# EAGLE design breakout (EAGLE 7.1.0)

## Sheet 1 of 2
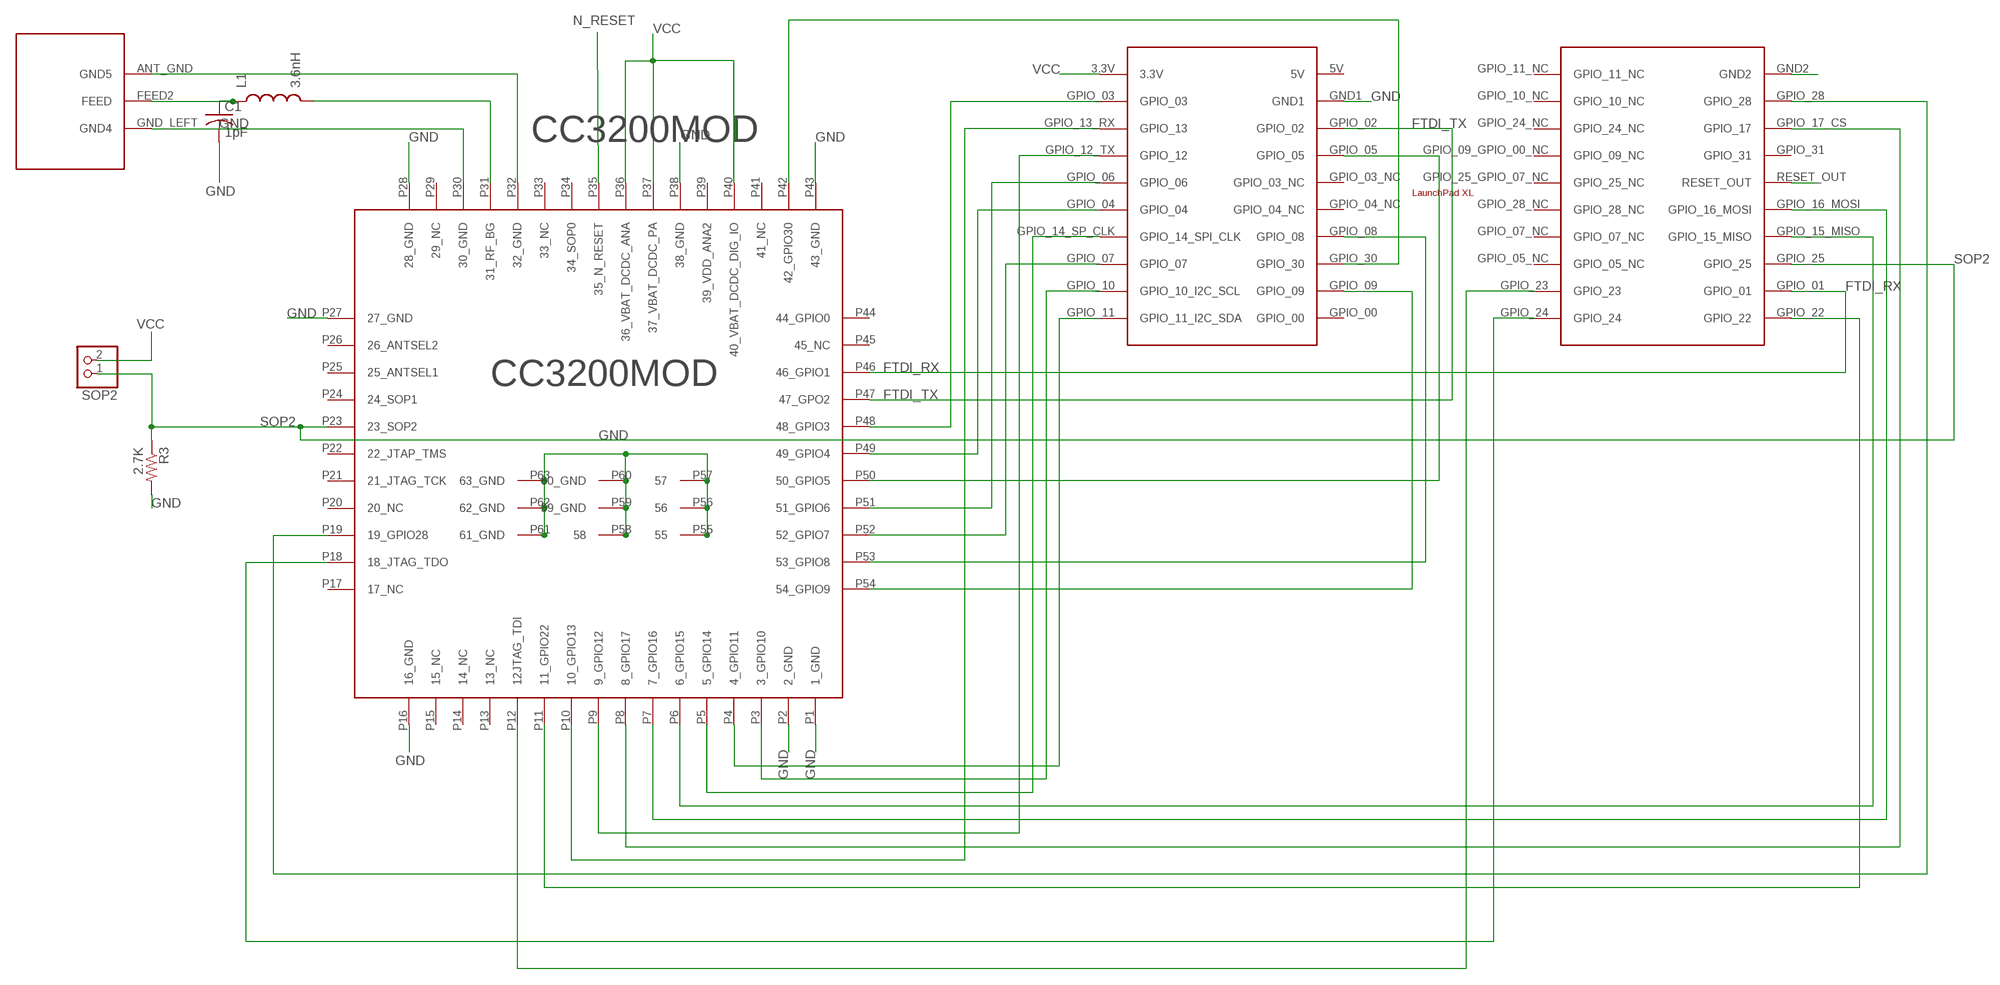
[diagram p0: schematic, sheet 1]

### Parts
ANT_PAD  ANT  [ANT]
C1  1pF  C-USC0402  [C0402]
CC3200MOD  CC3200  [CC3200MOD]
L1  3.6nH  INDUCTOR-SPARKFUN0402  [C0402]
R3  2.7K  RESISTOR0603  [0603-RES]
SOP2  PINHD-1X2  [1X02]
U11  XL  [LAUNCHPADXL]

### Nets
FTDI_RX: CC3200MOD.P46(46_GPIO1) U11.GPIO_01 ; also sheet 2
FTDI_TX: CC3200MOD.P47(47_GPO2) U11.GPIO_02 ; also sheet 2
GND: ANT_PAD.ANT_GND(GND5) ANT_PAD.GND_LEFT(GND4) C1.2 CC3200MOD.P1(1_GND) CC3200MOD.P2(2_GND) CC3200MOD.P16(16_GND) CC3200MOD.P27(27_GND) CC3200MOD.P28(28_GND) CC3200MOD.P30(30_GND) CC3200MOD.P32(32_GND) CC3200MOD.P38(38_GND) CC3200MOD.P43(43_GND) CC3200MOD.P55 CC3200MOD.P56 CC3200MOD.P57 CC3200MOD.P58 CC3200MOD.P59(59_GND) CC3200MOD.P60(60_GND) CC3200MOD.P61(61_GND) CC3200MOD.P62(62_GND) CC3200MOD.P63(63_GND) R3.2 U11.GND1 U11.GND2 ; also sheet 2
GPIO_05: CC3200MOD.P50(50_GPIO5) U11.GPIO_05 ; also sheet 2
GPIO_10: CC3200MOD.P3(3_GPIO10) U11.GPIO_10(GPIO_10_I2C_SCL) ; also sheet 2
GPIO_11: CC3200MOD.P4(4_GPIO11) U11.GPIO_11(GPIO_11_I2C_SDA) ; also sheet 2
GPIO_13: CC3200MOD.P10(10_GPIO13) U11.GPIO_13_RX(GPIO_13) ; also sheet 2
GPIO_22: CC3200MOD.P11(11_GPIO22) U11.GPIO_22
JTAG_TDI: CC3200MOD.P12(12JTAG_TDI) U11.GPIO_23
JTAG_TDO: CC3200MOD.P18(18_JTAG_TDO) U11.GPIO_24
N$2: ANT_PAD.FEED2(FEED) C1.1 L1.1
N$3: CC3200MOD.P31(31_RF_BG) L1.2
N$8: CC3200MOD.P6(6_GPIO15) U11.GPIO_15_MISO
N$10: CC3200MOD.P7(7_GPIO16) U11.GPIO_16_MOSI
N$11: CC3200MOD.P8(8_GPIO17) U11.GPIO_17_CS(GPIO_17)
N$12: CC3200MOD.P5(5_GPIO14) U11.GPIO_14_SP_CLK(GPIO_14_SPI_CLK)
N$13: CC3200MOD.P19(19_GPIO28) U11.GPIO_28
N$14: CC3200MOD.P42(42_GPIO30) U11.GPIO_30
N$18: CC3200MOD.P51(51_GPIO6) U11.GPIO_06
N$19: CC3200MOD.P49(49_GPIO4) U11.GPIO_04
N$21: CC3200MOD.P52(52_GPIO7) U11.GPIO_07
N$22: CC3200MOD.P53(53_GPIO8) U11.GPIO_08
N$23: CC3200MOD.P54(54_GPIO9) U11.GPIO_09
N$25: CC3200MOD.P9(9_GPIO12) U11.GPIO_12_TX(GPIO_12)
N$27: CC3200MOD.P48(48_GPIO3) U11.GPIO_03
N_RESET: CC3200MOD.P35(35_N_RESET) U11.RESET_OUT ; also sheet 2
SOP2: CC3200MOD.P23(23_SOP2) R3.1 SOP2.1 U11.GPIO_25 ; also sheet 2
VCC: CC3200MOD.P36(36_VBAT_DCDC_ANA) CC3200MOD.P37(37_VBAT_DCDC_PA) CC3200MOD.P40(40_VBAT_DCDC_DIG_IO) SOP2.2 U11.3.3V ; also sheet 2
Unconnected: CC3200MOD.P13(13_NC) CC3200MOD.P14(14_NC) CC3200MOD.P15(15_NC) CC3200MOD.P17(17_NC) CC3200MOD.P20(20_NC) CC3200MOD.P21(21_JTAG_TCK) CC3200MOD.P22(22_JTAP_TMS) CC3200MOD.P24(24_SOP1) CC3200MOD.P25(25_ANTSEL1) CC3200MOD.P26(26_ANTSEL2) CC3200MOD.P29(29_NC) CC3200MOD.P33(33_NC) CC3200MOD.P34(34_SOP0) CC3200MOD.P39(39_VDD_ANA2) CC3200MOD.P41(41_NC) CC3200MOD.P44(44_GPIO0) CC3200MOD.P45(45_NC) U11.5V U11.GPIO_00 U11.GPIO_03_NC U11.GPIO_04_NC U11.GPIO_05_NC U11.GPIO_07_NC U11.GPIO_09_GPIO_00_NC(GPIO_09_NC) U11.GPIO_10_NC U11.GPIO_11_NC U11.GPIO_24_NC U11.GPIO_25_GPIO_07_NC(GPIO_25_NC) U11.GPIO_28_NC U11.GPIO_31

## Sheet 2 of 2
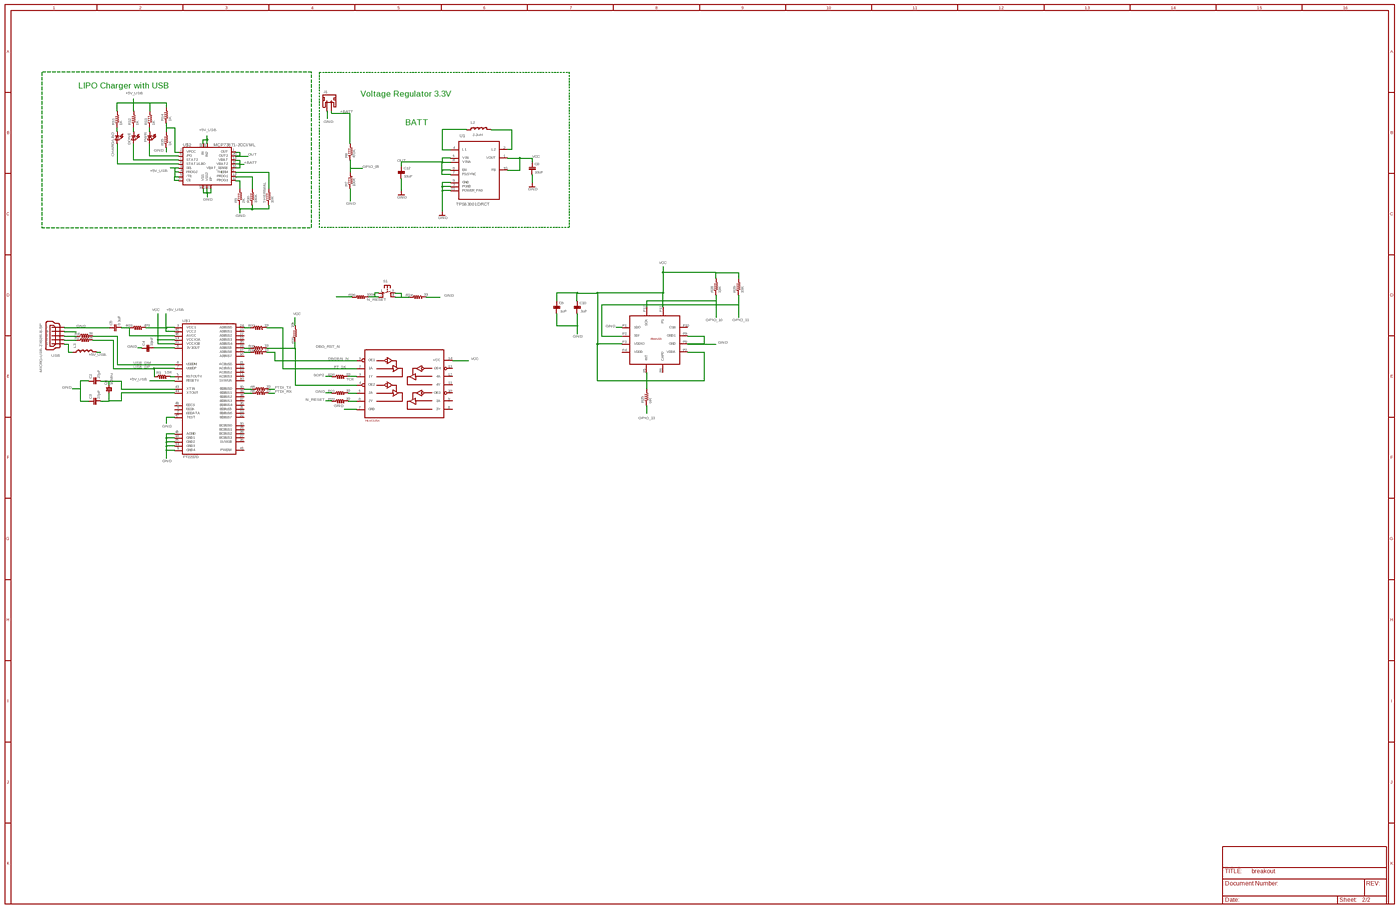
[diagram p1: schematic, sheet 2, overview]
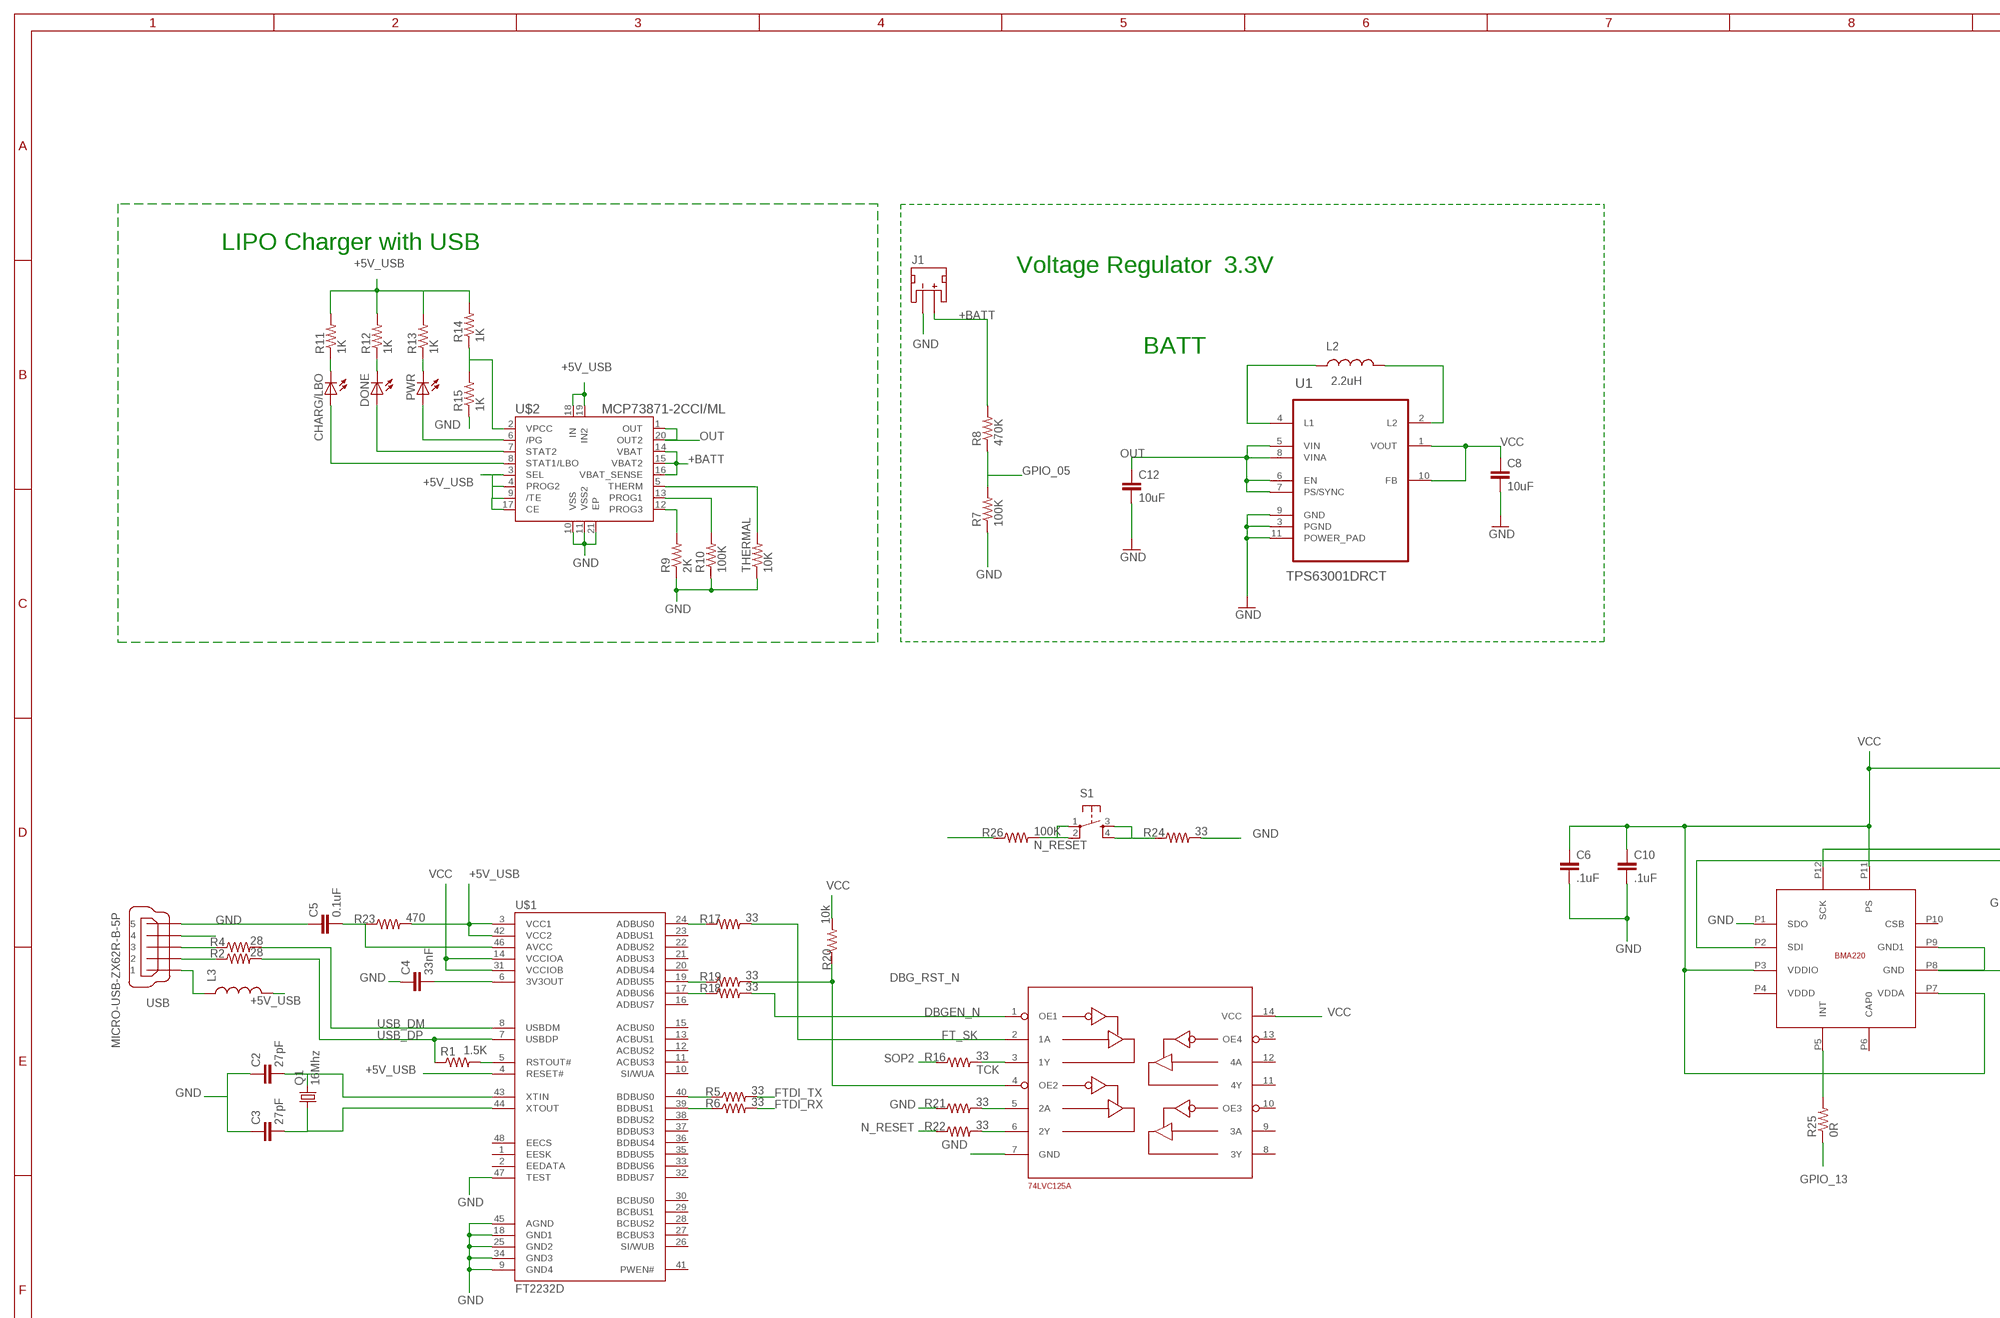
[diagram p2: schematic, sheet 2, part 1 of 4]
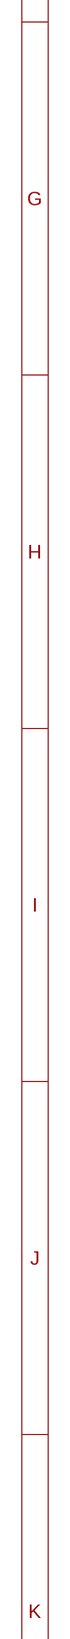
[diagram p3: schematic, sheet 2, part 2 of 4]
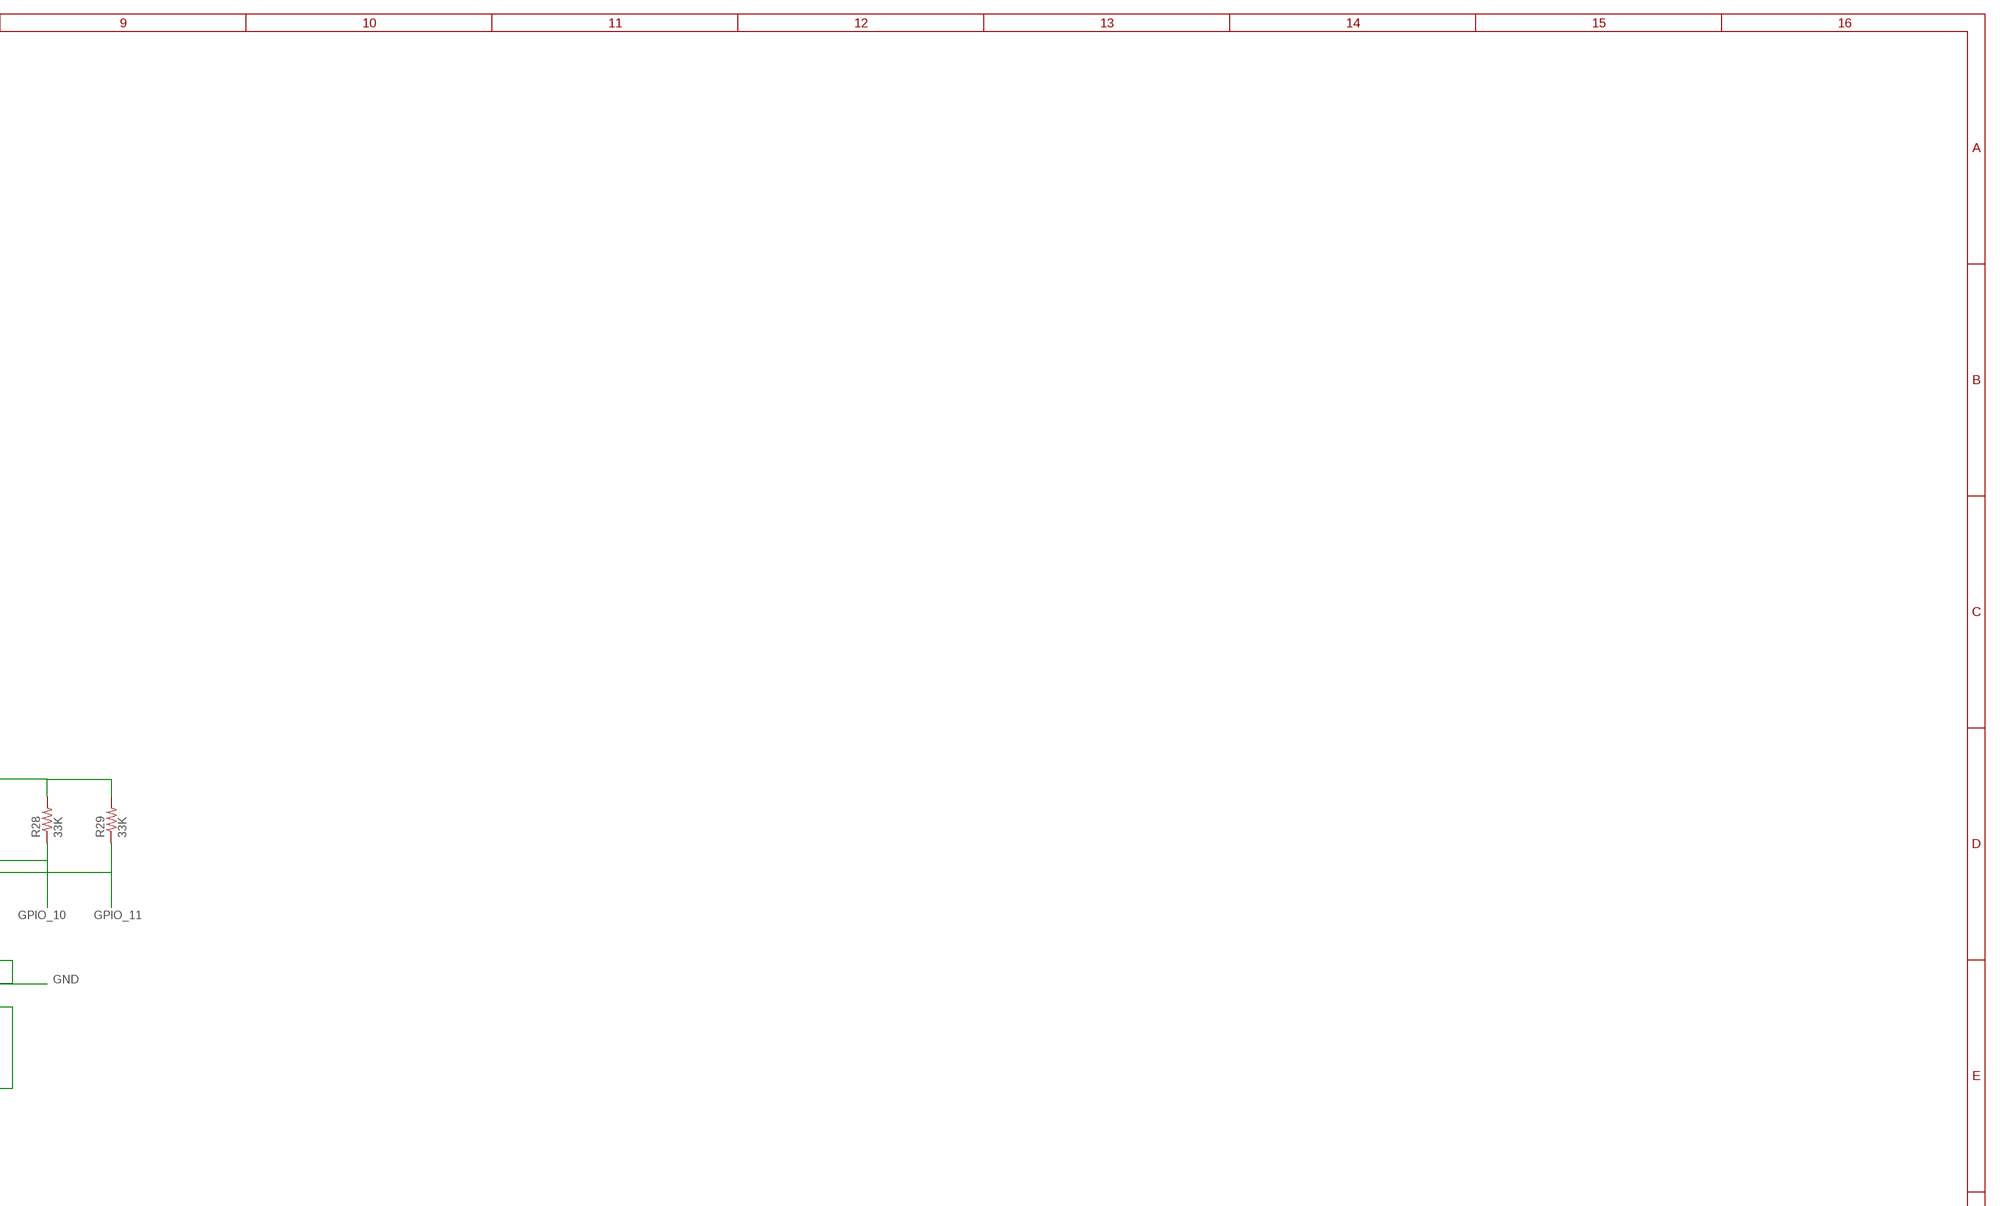
[diagram p4: schematic, sheet 2, part 3 of 4]
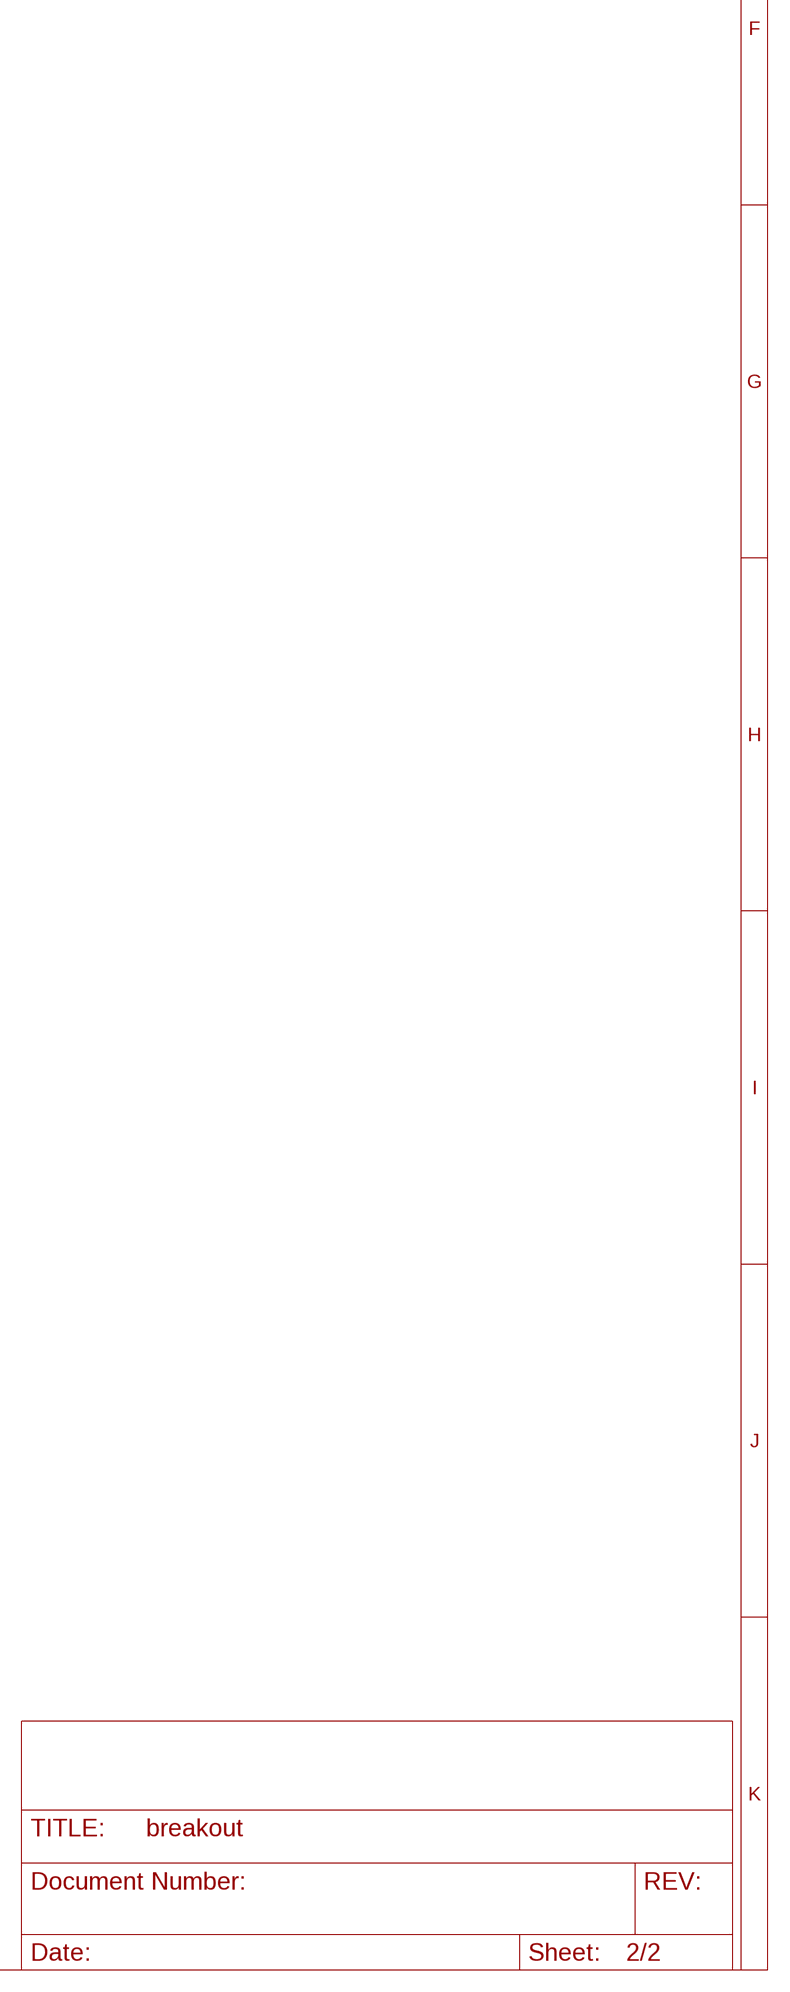
[diagram p5: schematic, sheet 2, part 4 of 4]

### Parts
C2  27pF  CAP0402-CAP  [0402-CAP]
C3  27pF  CAP0402-CAP  [0402-CAP]
C4  33nF  CAP0402-CAP  [0402-CAP]
C5  0.1uF  CAP0402-CAP  [0402-CAP]
C6  .1uF  CAP0402-CAP  [0402-CAP]
C8  10uF  C-EUC0603  [C0603]
C10  .1uF  CAP0402-CAP  [0402-CAP]
C12  10uF  C-EUC0603  [C0603]
CHARG/LBO  LEDSML0603  [SML0603]
DONE  LEDSML0603  [SML0603]
J1  JST_2MM_MALE  [JST-2-SMD]
L2  2.2uH  INDUCTOR0805  [0805]
L3  INDUCTOR-SPARKFUN0603  [0603]
PWR  LEDSML0603  [SML0603]
Q1  16Mhz  CRYSTALTC26H  [TC26H]
R1  1.5K  RESISTOR0603  [0603-RES]
R2  28  RESISTOR0603-RES  [0603-RES]
R4  28  RESISTOR0603-RES  [0603-RES]
R5  33  RESISTOR0603  [0603-RES]
R6  33  RESISTOR0603  [0603-RES]
R7  100K  RESISTOR0603  [0603-RES]
R8  470K  RESISTOR0603  [0603-RES]
R9  2K  RESISTOR0603-RES  [0603-RES]
R10  100K  RESISTOR0603-RES  [0603-RES]
R11  1K  RESISTOR0603-RES  [0603-RES]
R12  1K  RESISTOR0603-RES  [0603-RES]
R13  1K  RESISTOR0603-RES  [0603-RES]
R14  1K  RESISTOR0603-RES  [0603-RES]
R15  1K  RESISTOR0603-RES  [0603-RES]
R16  33  RESISTOR0603  [0603-RES]
R17  33  RESISTOR0603  [0603-RES]
R18  33  RESISTOR0603  [0603-RES]
R19  33  RESISTOR0603  [0603-RES]
R20  10k  RESISTOR0603  [0603-RES]
R21  33  RESISTOR0603  [0603-RES]
R22  33  RESISTOR0603  [0603-RES]
R23  470  RESISTOR0603  [0603-RES]
R24  33  RESISTOR0603  [0603-RES]
R25  0R  RESISTOR0603-RES  [0603-RES]
R26  100K  RESISTOR0603  [0603-RES]
R28  33K  RESISTOR0402-RES  [0402-RES]
R29  33K  RESISTOR0402-RES  [0402-RES]
S1  TAC_SWITCHSMD  [TACTILE_SWITCH_SMD]
THERMAL  10K  RESISTOR0603-RES  [0603-RES]
U1  TPS63001DRCT  [SON50P300X300X100-11N]
U$1  FT2232D  [LQFP-48]
U$2  MCP73871-2CCI/ML  [QFN20-4X4]
U$3  DECADE-74LVC125A  [DECADE-SO-14]
U$4  BMA220  [BMA222]
USB  MICRO-USB-ZX62R-B-5P  [ZX62R-B-5P]

### Nets
+5V_USB: L3.2 R11.2 R12.2 R13.2 R14.2 R23.2 U$1.3(VCC1) U$1.4(RESET#) U$1.42(VCC2) U$2.3(SEL) U$2.4(PROG2) U$2.9(/TE) U$2.17(CE) U$2.18(IN) U$2.19(IN2)
+BATT: J1.2(+) R8.2 U$2.14(VBAT) U$2.15(VBAT2) U$2.16(VBAT_SENSE)
DBG_RST_N: R19.2 R20.1 U$3.4(OE2)
DBGEN_N: R18.2 U$3.1(OE1)
FT_SK: R17.2 U$3.2(1A)
FTDI_RX: R6.2 ; also sheet 1
FTDI_TX: R5.2 ; also sheet 1
GND: C2.1 C3.1 C4.1 C5.1 C6.2 C8.2 C10.2 C12.2 J1.1(-) R7.1 R9.1 R10.1 R15.1 R21.1 R24.2 THERMAL.1 U1.3(PGND) U1.9(GND) U1.11(POWER_PAD) U$1.9(GND4) U$1.18(GND1) U$1.25(GND2) U$1.34(GND3) U$1.45(AGND) U$1.47(TEST) U$2.10(VSS) U$2.11(VSS2) U$2.21(EP) U$3.7(GND) U$4.P1(SDO) U$4.P8(GND) U$4.P9(GND1) USB.5 ; also sheet 1
GPIO_05: R7.2 R8.1 ; also sheet 1
GPIO_10: R28.1 U$4.P12(SCK) ; also sheet 1
GPIO_11: R29.1 U$4.P2(SDI) ; also sheet 1
GPIO_13: R25.1 ; also sheet 1
N$7: R1.2 U$1.5(RSTOUT#)
N$15: L3.1 USB.1
N$17: R9.2 U$2.12(PROG3)
N$20: R10.2 U$2.13(PROG1)
N$26: PWR.A U$2.6(/PG)
N$28: THERMAL.2 U$2.5(THERM)
N$29: L2.1 U1.4(L1)
N$30: L2.2 U1.2(L2)
N$31: DONE.A U$2.7(STAT2)
N$32: CHARG/LBO.A U$2.8(STAT1/LBO)
N$33: CHARG/LBO.C R11.1
N$35: DONE.C R12.1
N$36: PWR.C R13.1
N$37: R14.1 R15.2 U$2.2(VPCC)
N$38: C2.2 Q1.2 U$1.43(XTIN)
N$39: USB.4
N$40: C3.2 Q1.1 U$1.44(XTOUT)
N$41: R4.1 USB.3
N$42: R2.1 USB.2
N$43: C4.2 U$1.6(3V3OUT)
N$44: R5.1 U$1.40(BDBUS0)
N$45: R6.1 U$1.39(BDBUS1)
N$46: R17.1 U$1.24(ADBUS0)
N$47: R19.1 U$1.19(ADBUS5)
N$48: R18.1 U$1.17(ADBUS6)
N$49: R21.2 U$3.5(2A)
N$50: R22.2 U$3.6(2Y)
N$51: C5.2 R23.1 U$1.46(AVCC)
N$52: R25.2 U$4.P5(INT)
N$53: R24.1 S1.3 S1.4
N_RESET: R22.1 R26.2 S1.1 S1.2 ; also sheet 1
OUT: C12.1 U1.5(VIN) U1.6(EN) U1.7(PS/SYNC) U1.8(VINA) U$2.1(OUT) U$2.20(OUT2)
SOP2: R16.1 ; also sheet 1
TCK: R16.2 U$3.3(1Y)
USB_DM: R4.2 U$1.8(USBDM)
USB_DP: R1.1 R2.2 U$1.7(USBDP)
VCC: C6.1 C8.1 C10.1 R20.2 R26.1 R28.2 R29.2 U1.1(VOUT) U1.10(FB) U$1.14(VCCIOA) U$1.31(VCCIOB) U$3.14(VCC) U$4.P3(VDDIO) U$4.P7(VDDA) U$4.P11(PS) ; also sheet 1
Unconnected: J1.NC1(PAD1) J1.NC2(PAD2) U$1.1(EESK) U$1.2(EEDATA) U$1.10(SI/WUA) U$1.11(ACBUS3) U$1.12(ACBUS2) U$1.13(ACBUS1) U$1.15(ACBUS0) U$1.16(ADBUS7) U$1.20(ADBUS4) U$1.21(ADBUS3) U$1.22(ADBUS2) U$1.23(ADBUS1) U$1.26(SI/WUB) U$1.27(BCBUS3) U$1.28(BCBUS2) U$1.29(BCBUS1) U$1.30(BCBUS0) U$1.32(BDBUS7) U$1.33(BDBUS6) U$1.35(BDBUS5) U$1.36(BDBUS4) U$1.37(BDBUS3) U$1.38(BDBUS2) U$1.41(PWEN#) U$1.48(EECS) U$3.8(3Y) U$3.9(3A) U$3.10(OE3) U$3.11(4Y) U$3.12(4A) U$3.13(OE4) U$4.P4(VDDD) U$4.P6(CAP0) U$4.P10(CSB)

### Notes on the sheet
- LIPO Charger with USB
- Voltage Regulator | 3.3V
- BATT

## Library data of the parts
ANT_PAD = Antenna:ANT
C1 = rcl:C-US: CAPACITOR, American symbol
C2-C5 = SparkFun-Passives:CAP: Capacitor Standard 0603 ceramic capacitor, and 0.1" leaded capacitor.
C6 C10 = SparkFun-Capacitors:CAP: Capacitor Standard 0603 ceramic capacitor, and 0.1" leaded capacitor.
C8 C12 = rcl:C-EU: CAPACITOR, European symbol
CC3200MOD = cc3200mod:CC3200
CHARG/LBO DONE PWR = led:LED: LED OSRAM: - CHIPLED LG R971, LG N971, LY N971, LG Q971, LY Q971, LO R971, LY R971 LH N974, LH R974 LS Q976, LO Q976, LY Q976 LO Q996 - Hyper CHIPLED LW Q18S LB Q993, LB Q99A, LB R99A - SideLED LS A670, LO A670, LY A670, LG A670, LP A670 LB A673, LV A673, LT A673, LW A673 LH A674 LY A675 LS A676, LA A676, LO A676, LY A676, LW A676 LS A679, LY A679, LG A679 - Hyper Micro SIDELED® LS Y876, LA Y876, LO Y876, LY Y876 LT Y87S - SmartLED LW L88C, LW L88S LB L89C, LB L89S, LG L890 LS L89K, LO L89K, LY L89K LS L896, LA L896, LO L896, LY L896 - TOPLED LS T670, LO T670, LY T670, LG T670, LP T670 LSG T670, LSP T670, LSY T670, LOP T670, LYG T670 LG T671, LOG T671, LSG T671 LB T673, LV T673, LT T673, LW T673 LH T674 LS T676, LA T676, LO T676, LY T676, LB T676, LH T676, LSB T676, LW T676 LB T67C, LV T67C, LT T67C, LS T67K, LO T67K, LY T67K, LW E67C LS E67B, LA E67B, LO E67B, LY E67B, LB E67C, LV E67C, LT E67C LW T67C LS T679, LY T679, LG T679 LS T770, LO T770, LY T770, LG T770, LP T770 LB T773, LV T773, LT T773, LW T773 LH T774 LS E675, LA E675, LY E675, LS T675 LS T776, LA T776, LO T776, LY T776, LB T776 LHGB T686 LT T68C, LB T68C - Hyper Mini TOPLED® LB M676 - Mini TOPLED Santana® LG M470 LS M47K, LO M47K, LY M47K Source: http://www.osram.convergy.de LUXEON: - LUMILED® LXK2-PW12-R00, LXK2-PW12-S00, LXK2-PW14-U00, LXK2-PW14-V00 LXK2-PM12-R00, LXK2-PM12-S00, LXK2-PM14-U00 LXK2-PE12-Q00, LXK2-PE12-R00, LXK2-PE12-S00, LXK2-PE14-T00, LXK2-PE14-U00 LXK2-PB12-K00, LXK2-PB12-L00, LXK2-PB12-M00, LXK2-PB14-N00, LXK2-PB14-P00, LXK2-PB14-Q00 LXK2-PR12-L00, LXK2-PR12-M00, LXK2-PR14-Q00, LXK2-PR14-R00 LXK2-PD12-Q00, LXK2-PD12-R00, LXK2-PD12-S00 LXK2-PH12-R00, LXK2-PH12-S00 LXK2-PL12-P00, LXK2-PL12-Q00, LXK2-PL12-R00 Source: www.luxeon.com KINGBRIGHT: KA-3528ASYC Source: www.kingbright.com
J1 = SparkFun-Connectors:JST_2MM_MALE: Mates to single-cell LiPo batteries. CONN-08352; PROD_ID: CONN-08352
L1 L3 = Spark:INDUCTOR-SPARKFUN: Inductors Basic Inductor/Choke - 0603 and 1206. Footprints are not proven and vary greatly between part numbers. SRN6045- 33uH, 20% 1.4A
L2 = SparkFun-Passives:INDUCTOR: Inductors Basic Inductor/Choke - 0603 and 1206. Footprints are not proven and vary greatly between part numbers. SRN6045- 33uH, 20% 1.4A SDR0403-560KL - 56uH, 10%, 500mA RMS/740mA peak
Q1 = crystal:CRYSTAL: CRYSTAL; OC_FARNELL: unknown; OC_NEWARK: unknown
R1 R3 R5-R8 R16-R24 R26 = SparkFun-Resistors:RESISTOR: Resistor Basic schematic elements and footprints for 0603, 1206, and PTH resistors.
R2 R4 R9-R15 R25 R28 R29 THERMAL = SparkFun-Passives:RESISTOR: Resistor Basic schematic elements and footprints for 0603, 1206, and PTH resistors.
S1 = Spark:TAC_SWITCH: SMD Tactiile Switch
SOP2 = pinhead:PINHD-1X2: PIN HEADER
U1 = TPS63001:TPS63001DRCT: HIGH EFFICIENT SINGLE INDUCTOR BUCK-BOOST CONVERTER WITH 1.8-A SWITCHES; MPN: TPS63001DRCT; OC_FARNELL: 1652399; OC_NEWARK: 22M1824; PACKAGE: SON-10; SUPPLIER: TEXAS INSTRUMENTS
U11 = LaunchPadXL:XL
U$1 = SparkFun-DigitalIC:FT2232D: USB to USART/FIFO/JTAG/SPI/I2C
U$2 = microchip-battery:MCP73871: Stand-Alone System Load Sharing and Li-Ion / Li-Polymer Battery Charge Managemen The MCP73871 device is a 1A fully integrated linear solution for system load sharing and Li-Ion / Li-Polymer battery charge management with AC-DC wall adapter and USB port power sources selection. It?s also capable of autonomous power source selection between input or battery. The MCP73871 device employs a constant current/constant voltage (CC/CV) charge algorithm with selectable charge termination point. The constant voltage regulation is fixed with four available options: 4.10V, 4.20V, 4.35V, or 4.40V.; LBO: 3.1 V; SAFETYTIMER: 6 Hours; VREG: 4.20V
U$3 = DECADE-libraries:DECADE-74LVC125A
U$4 = bma220:BMA220: The BMA220 is an ultra small triaxial, low-g acceleration sensor with digital interfaces, aiming for low-power consumer market applications.
USB = con-hirose:MICRO-USB-: Hirose Micro USB Connector ZX62R-B-5P: Micro B, reverse (top mount) shell SMT Supplier: DigiKey H11574CT-ND Source: http://www.hirose.co.jp/cataloge_hp/e24200011.pdf

## Board
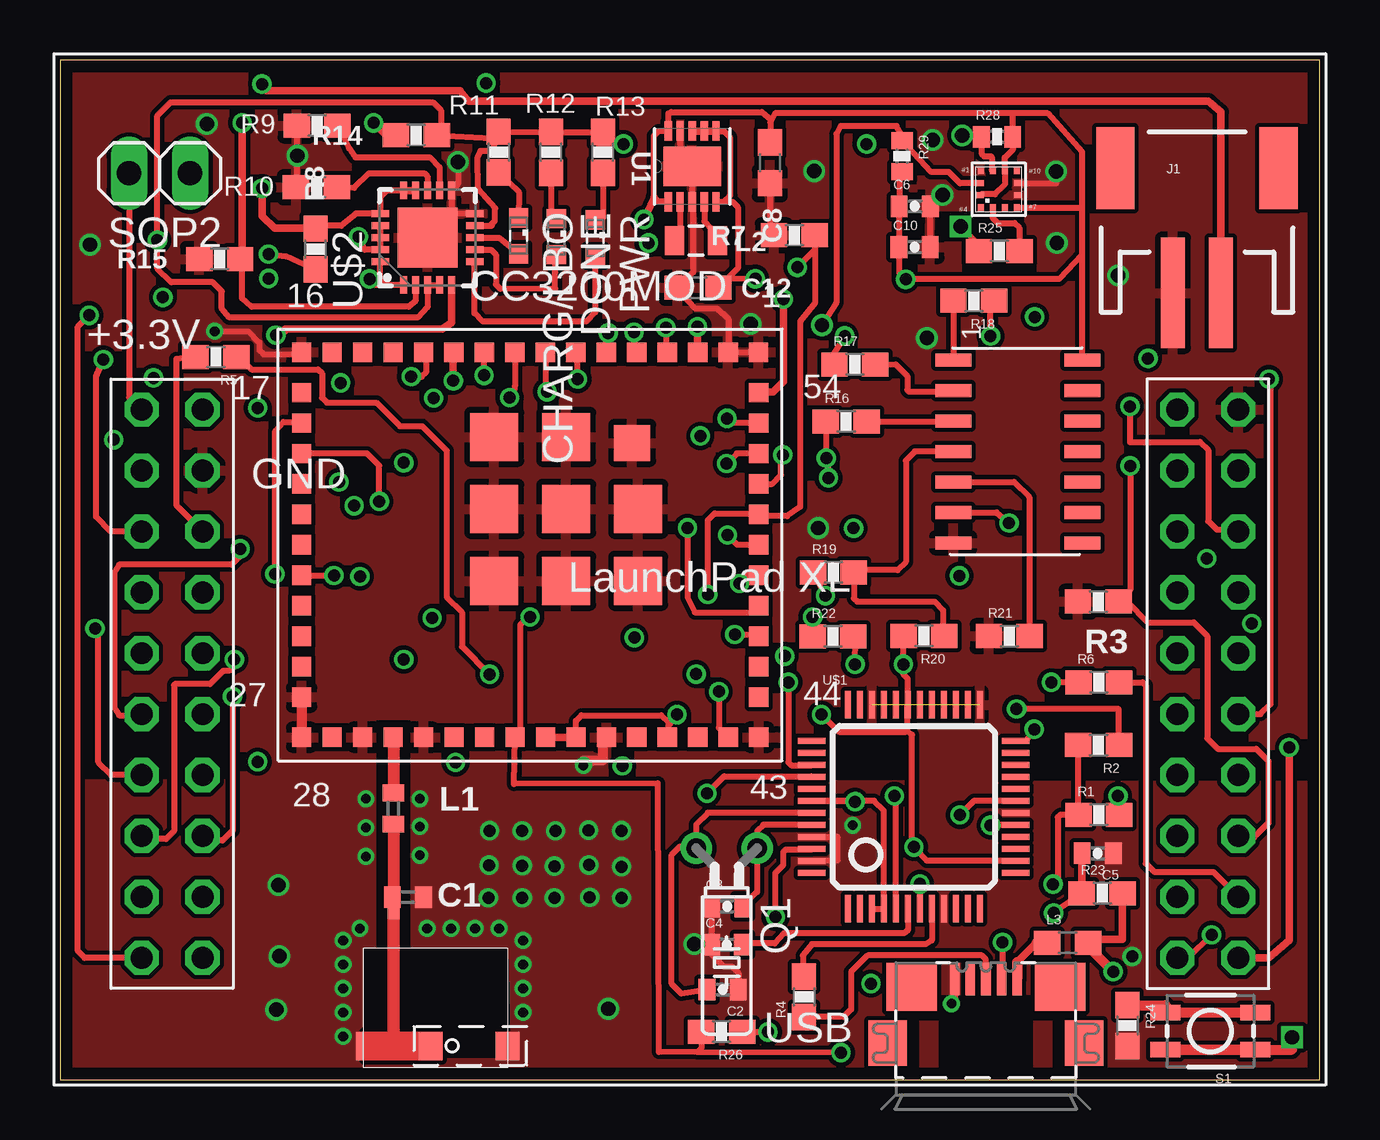
[diagram p6: board, top side]
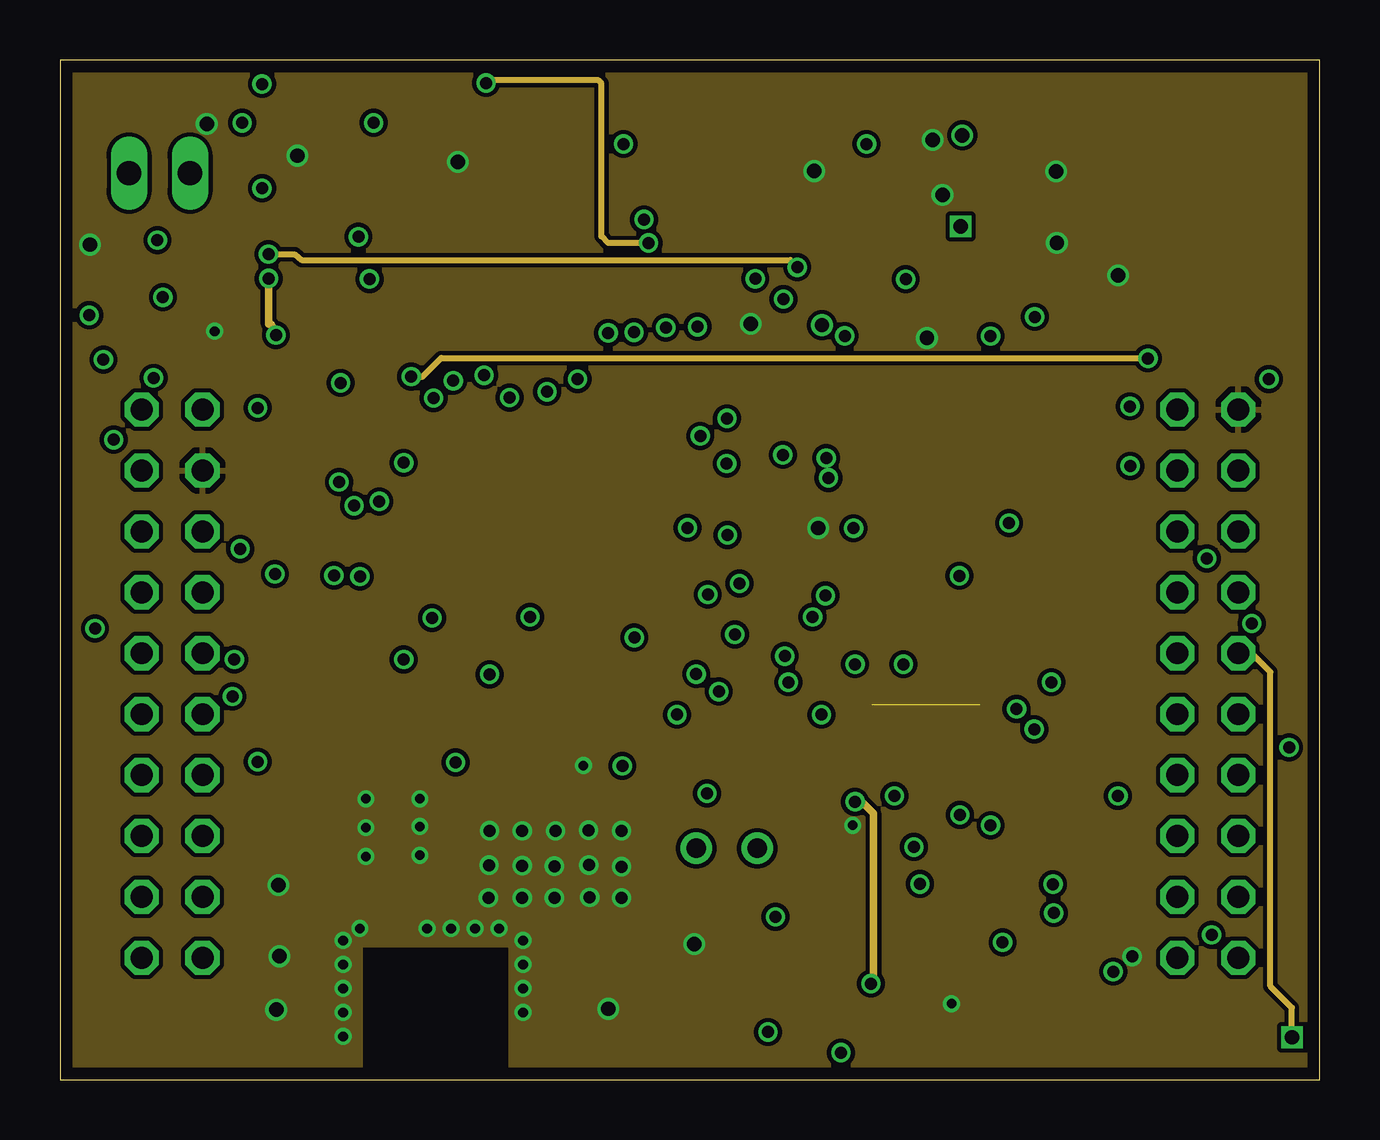
[diagram p7: board, inner layer Route2]
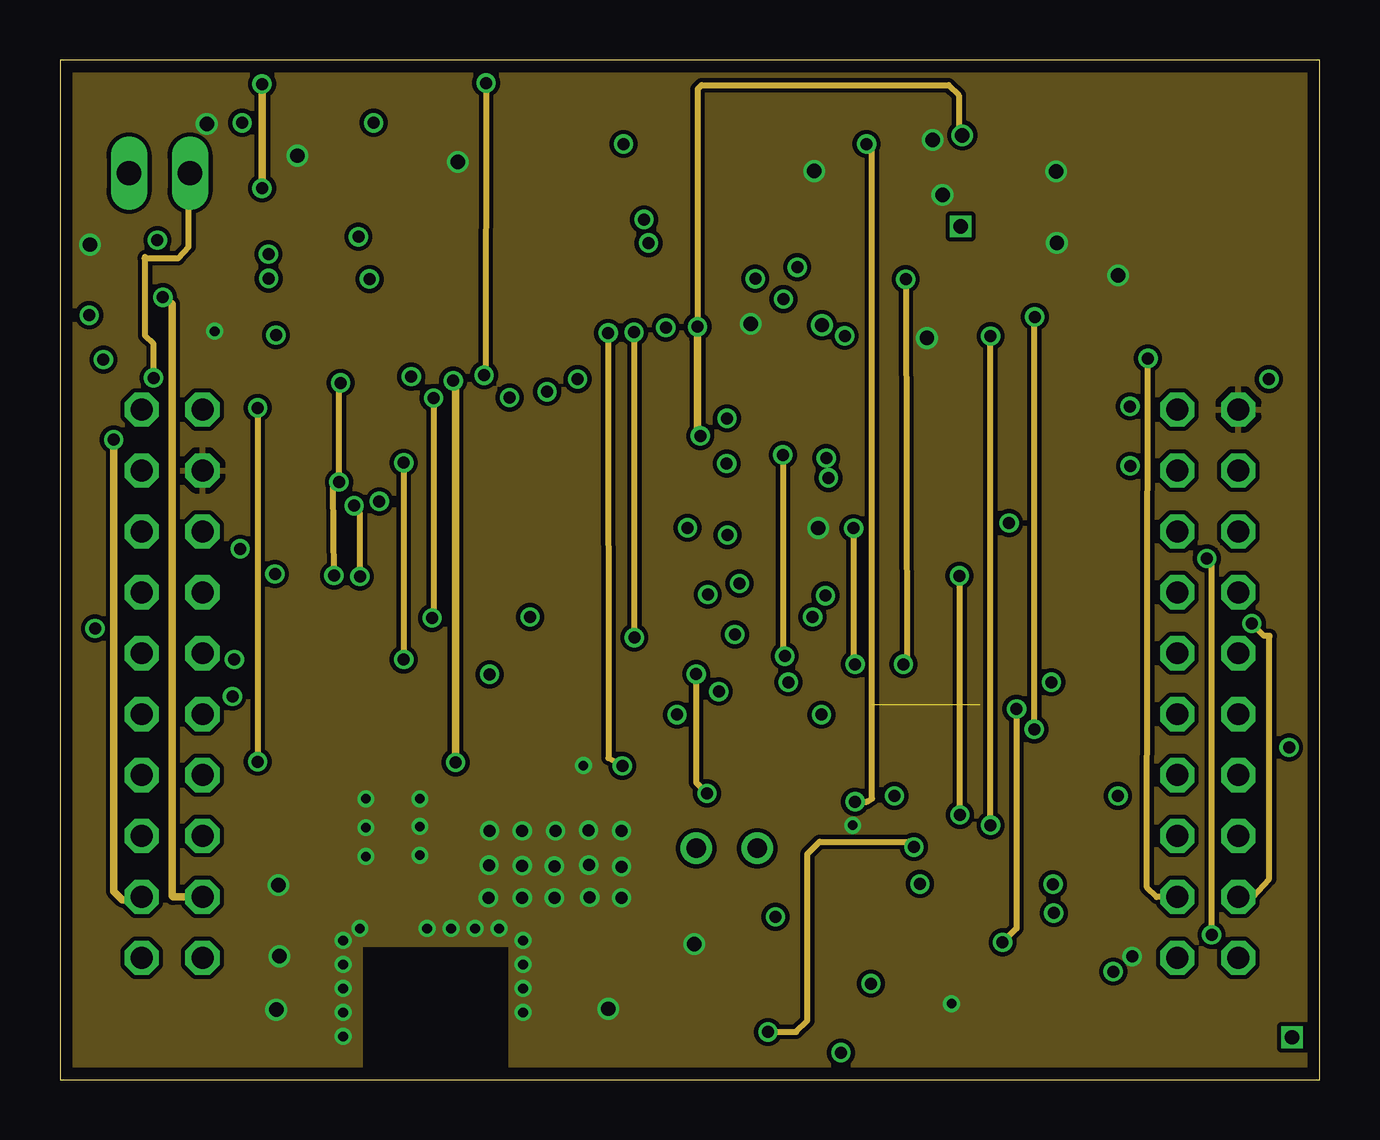
[diagram p8: board, inner layer Route15]
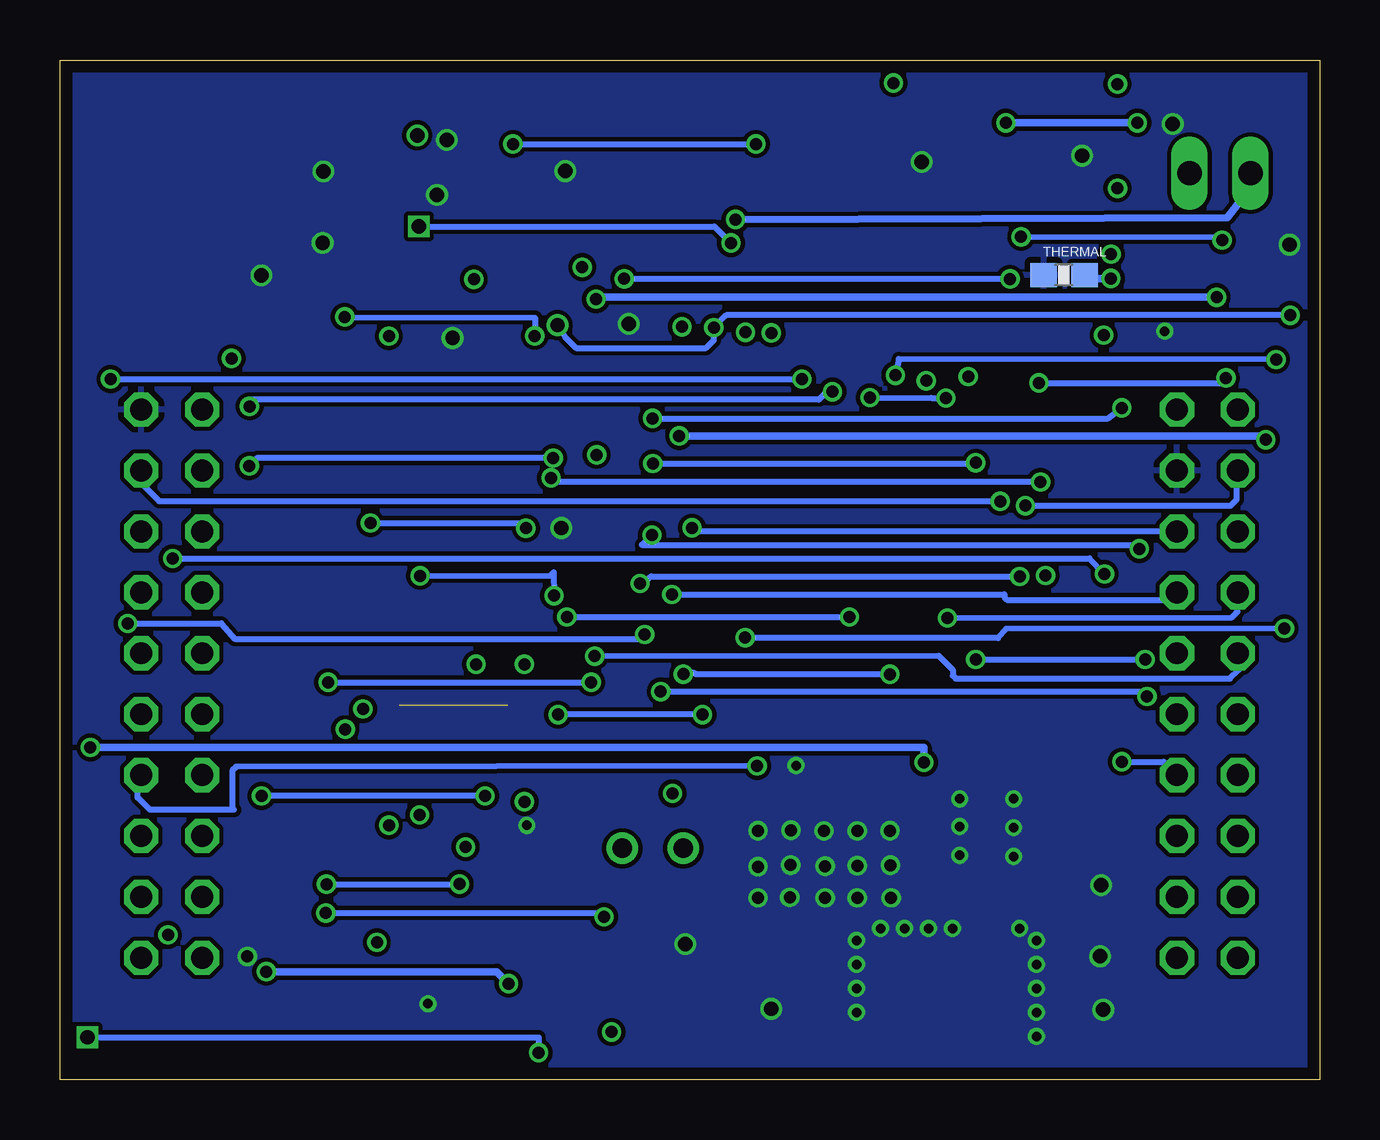
[diagram p9: board, bottom side, seen from below]

Size 52.5 x 42.5 mm. Coordinates in mm from the lower left corner, seen from the top.
Outline: 0,0 52.5,0 52.5,42.5 0,42.5 0,0
Copper layers (1*2*15*16): Top 0.035mm / dielectric 10mil / Route2 0.035mm / dielectric 10mil / Route15 0.035mm / dielectric 10mil / Bottom 0.035mm
Design rules "EagleRules *": minimum track width 7mil, minimum drill 12mil, track to track 7mil, track to pad 7mil, pad to pad 7mil, via to via 7mil, smd to smd 0mil, copper to edge 20mil, drill to drill 10mil, minimum pad ring 10mil, minimum via ring 6mil, stop-mask expansion 2mil, vias tented up to drill 25mil, thermal gap 10mil

### Footprints (pad centres in the part's own frame; a part is rotated, then mirrored left to right if it is on the bottom)
ANT = smd 1 x 1.2: ANT_FEED 2.8,0.9; ANT_GND 6,0.9 | smd 0.5 x 0.5: FEED2 1.25,6.45 | smd 0.3 x 1.2: GND_LEFT -0.15,0.9
C0402 = smd 0.7 x 0.9: 1 -0.65,0; 2 0.65,0
0402-CAP = smd 0.7 x 0.9: 1 -0.65,0; 2 0.65,0
C0603 = smd 1.1 x 1: 1 -0.85,0; 2 0.85,0
CC3200MOD = smd 0.8 x 0.8: P1 9.52,8.025; P2 8.25,8.025; P3 6.98,8.025; P4 5.71,8.025; P5 4.44,8.025; P6 3.17,8.025; P7 1.9,8.025; P8 0.63,8.025; P9 -0.64,8.025; P10 -1.91,8.025; P11 -3.18,8.025; P12 -4.45,8.025; P13 -5.72,8.025; P14 -6.99,8.025; P15 -8.26,8.025; P16 -9.53,8.025; P17 -9.525,6.35; P18 -9.525,5.08; P19 -9.525,3.81; P20 -9.525,2.54; P21 -9.525,1.27; P22 -9.525,0; P23 -9.525,-1.27; P24 -9.525,-2.54; P25 -9.525,-3.81; P26 -9.525,-5.08; P27 -9.525,-6.35; P28 -9.525,-8.02; P29 -8.255,-8.02; P30 -6.985,-8.02; P31 -5.715,-8.02; P32 -4.445,-8.02; P33 -3.175,-8.02; P34 -1.905,-8.02; P35 -0.635,-8.02; P36 0.635,-8.02; P37 1.905,-8.02; P38 3.175,-8.02; P39 4.445,-8.02; P40 5.715,-8.02; P41 6.985,-8.02; P42 8.255,-8.02; P43 9.525,-8.02; P44 9.525,-6.35; P45 9.525,-5.08; P46 9.525,-3.81; P47 9.525,-2.54; P48 9.525,-1.27; P49 9.525,0; P50 9.525,1.27; P51 9.525,2.54; P52 9.525,3.81; P53 9.525,5.08; P54 9.525,6.35 | smd 1.5 x 1.5: P55 4.25,4.25 | smd 2 x 2: P56 1.5,-1.5; P57 -1.5,4.5; P58 4.5,1.5; P59 1.5,1.5; P60 -1.5,1.5; P61 4.5,-1.5; P62 1.5,4.5; P63 -1.5,-1.5
SML0603 = smd 0.8 x 0.8: A 0.75,0; C -0.75,0
JST-2-SMD = smd 1 x 4.6: 1 -1,-3.7; 2 1,-3.7 | smd 1.6 x 3.4: NC1 -3.4,1.5; NC2 3.4,1.5
0805 = smd 0.8 x 1.2: 1 -0.9,0; 2 0.9,0
0603 = smd 1.1 x 1: 1 -0.85,0; 2 0.85,0
TC26H = drill 0.813: 1 -1.27,0; 2 1.27,0
0603-RES = smd 1.1 x 1: 1 -0.85,0; 2 0.85,0
0402-RES = smd 0.7 x 0.9: 1 -0.65,0; 2 0.65,0
TACTILE_SWITCH_SMD = smd 1.25 x 0.65: 1 -1.875,0.775; 2 1.875,0.775; 3 -1.875,-0.775; 4 1.875,-0.775
1X02 = drill 1.016 long: 1 -1.27,0; 2 1.27,0
SON50P300X300X100-11N = smd 0.813 x 0.305: 1 -1.473,0.991; 2 -1.473,0.508; 3 -1.473,0; 4 -1.473,-0.508; 5 -1.473,-0.991; 6 1.473,-0.991; 7 1.473,-0.508; 8 1.473,0; 9 1.473,0.508; 10 1.473,0.991 | smd 1.651 x 2.388: 11 0,0
LAUNCHPADXL = drill 0.914 octagon: 3.3V -22.86,8.16; 5V -20.32,8.16; GND1 -20.32,5.62; GND2 22.86,8.16; GPIO_00 -20.32,-14.7; GPIO_01 22.86,-12.16; GPIO_02 -20.32,3.08; GPIO_03 -22.86,5.62; GPIO_03_NC -20.32,-2; GPIO_04 -22.86,-4.54; GPIO_04_NC -20.32,-4.54; GPIO_05 -20.32,0.54; GPIO_05_NC 20.32,-9.62; GPIO_06 -22.86,-2; GPIO_07 -22.86,-9.62; GPIO_07_NC 20.32,-7.08; GPIO_08 -20.32,-7.08; GPIO_09 -20.32,-12.16; GPIO_09_GPIO_00_NC 20.32,0.54; GPIO_10 -22.86,-12.16; GPIO_10_NC 20.32,5.62; GPIO_11 -22.86,-14.7; GPIO_11_NC 20.32,8.16; GPIO_12_TX -22.86,0.54; GPIO_13_RX -22.86,3.08; GPIO_14_SP_CLK -22.86,-7.08; GPIO_15_MISO 22.86,-7.08; GPIO_16_MOSI 22.86,-4.54; GPIO_17_CS 22.86,3.08; GPIO_22 22.86,-14.7; GPIO_23 20.32,-12.16; GPIO_24 20.32,-14.7; GPIO_24_NC 20.32,3.08; GPIO_25 22.86,-9.62; GPIO_25_GPIO_07_NC 20.32,-2; GPIO_28 22.86,5.62; GPIO_28_NC 20.32,-4.54; GPIO_30 -20.32,-9.62; GPIO_31 22.86,0.54; RESET_OUT 22.86,-2
LQFP-48 = smd 0.254 x 1.143: 1 -2.75,-4.25; 2 -2.25,-4.25; 3 -1.75,-4.25; 4 -1.25,-4.25; 5 -0.75,-4.25; 6 -0.25,-4.25; 7 0.25,-4.25; 8 0.75,-4.25; 9 1.25,-4.25; 10 1.75,-4.25; 11 2.25,-4.25; 12 2.75,-4.25; 25 2.75,4.25; 26 2.25,4.25; 27 1.75,4.25; 28 1.25,4.25; 29 0.75,4.25; 30 0.25,4.25; 31 -0.25,4.25; 32 -0.75,4.25; 33 -1.25,4.25; 34 -1.75,4.25; 35 -2.25,4.25; 36 -2.75,4.25 | smd 1.143 x 0.254: 13 4.25,-2.75; 14 4.25,-2.25; 15 4.25,-1.75; 16 4.25,-1.25; 17 4.25,-0.75; 18 4.25,-0.25; 19 4.25,0.25; 20 4.25,0.75; 21 4.25,1.25; 22 4.25,1.75; 23 4.25,2.25; 24 4.25,2.75; 37 -4.25,2.75; 38 -4.25,2.25; 39 -4.25,1.75; 40 -4.25,1.25; 41 -4.25,0.75; 42 -4.25,0.25; 43 -4.25,-0.25; 44 -4.25,-0.75; 45 -4.25,-1.25; 46 -4.25,-1.75; 47 -4.25,-2.25; 48 -4.25,-2.75
QFN20-4X4 = smd 0.73 x 0.3: 1 -1.965,1; 2 -1.965,0.5; 3 -1.965,0; 4 -1.965,-0.5; 5 -1.965,-1; 11 1.965,-1; 12 1.965,-0.5; 13 1.965,0; 14 1.965,0.5; 15 1.965,1 | smd 0.3 x 0.73: 6 -1,-1.965; 7 -0.5,-1.965; 8 0,-1.965; 9 0.5,-1.965; 10 1,-1.965; 16 1,1.965; 17 0.5,1.965; 18 0,1.965; 19 -0.5,1.965; 20 -1,1.965 | smd 2.5 x 2.5: 21 0,0
DECADE-SO-14 = smd 0.55 x 1.5: 1 -3.6,-2.88; 2 -2.33,-2.88; 3 -1.06,-2.88; 4 0.21,-2.88; 5 1.48,-2.88; 6 2.75,-2.88; 7 4.02,-2.88; 8 4.02,2.5; 9 2.75,2.5; 10 1.48,2.5; 11 0.21,2.5; 12 -1.06,2.5; 13 -2.33,2.5; 14 -3.6,2.5
BMA222 = smd 0.25 x 0.3: P1 -0.75,0.775; P4 -0.75,-0.775; P5 -0.25,-0.775; P6 0.25,-0.775; P7 0.75,-0.775; P10 0.75,0.775; P11 0.25,0.775; P12 -0.25,0.775 | smd 0.3 x 0.25: P2 -0.775,0.25; P3 -0.775,-0.25; P8 0.775,-0.25; P9 0.775,0.25
ZX62R-B-5P = smd 1.35 x 0.4: 1 2.675,-1.3; 2 2.675,-0.65; 3 2.675,0; 4 2.675,0.65; 5 2.675,1.3 | smd 1.9 x 1.6: M1 0,-4.1; M2 0,4.1 | smd 2 x 2.1: M3 2.35,3.1; M4 2.35,-3.1

### Placement (x,y rotation side)
ANT_PAD  12.65,0.5 0 top
C1  14.5,7.6 0 top
C2  27.62,3.75 180 top
C3  27.81,7.22 0 top
C4  27.8,5.62 0 top
C5  43.25,9.43 180 top
C6  35.63,36.4 0 top
C8  29.59,38.22 270 top
C10  35.62,34.7 0 top
C12  26.6,33 180 top
CC3200MOD  19.6,22.29 0 top
CHARG/LBO  19.11,35.17 270 top
DONE  20.69,35.14 270 top
J1  47.39,36.49 0 top
L1  13.9,11.3 90 top
L2  26.51,34.96 180 top
L3  42,5.7 0 top
PWR  22.31,35.08 270 top
Q1  27.79,9.64 180 top
R1  43.3,11.04 0 top
R2  43.29,13.94 180 top
R3  43.28,19.92 180 top
R4  31.02,3.45 90 top
R5  6.5,30.12 180 top
R6  43.3,16.56 0 top
R7  30.61,35.19 0 top
R8  10.66,34.62 90 top
R9  10.72,39.77 0 top
R10  10.69,37.19 0 top
R11  18.29,38.66 90 top
R12  20.46,38.65 90 top
R13  22.63,38.65 90 top
R14  14.85,39.36 0 top
R15  6.66,34.2 0 top
R16  32.77,27.43 0 top
R17  33.13,29.81 0 top
R18  38.09,32.46 180 top
R19  32.24,21.14 0 top
R20  36.01,18.5 180 top
R21  39.57,18.48 0 top
R22  32.22,18.47 0 top
R23  43.44,7.77 0 top
R24  44.49,2.25 270 top
R25  39.15,34.53 0 top
R26  27.58,2 180 top
R28  39.06,39.3 0 top
R29  35.1,38.49 270 top
S1  47.95,2.02 180 top
SOP2  4.15,37.78 180 top
THERMAL  10.65,33.54 0 bottom
U1  26.35,38.06 90 top
U11  26.26,19.77 0 top
U$1  35.59,11.37 0 top
U$2  15.32,35.09 90 top
U$3  40.11,26.39 270 top
U$4  39.13,37.11 0 top
USB  38.59,1.51 90 top

### Tracks (layer width: path | path; a pad name or v marks a point on that pad's centre or on a via)
+5V_USB  (via drill 0.5)
  Top 0.254: U$2.17 U$2.18 U$2.19 12.71,34.59 v12.44,35.13 | U$2.4 U$2.3 15.32,32.19 14.92,31.77 7.06,31.77 6.74,32.13 6.74,32.86 6.37,33.23 4.64,33.23 4.06,33.81 v4.06,34.99 4.06,40.18 4.61,40.73 15.55,40.73 15.88,40.4 15.88,39.41 R14.2 18.01,39.24 R11.2 | R11.2 20.48,39.5 R12.2 R13.2 22.61,39 v23.49,39 | U$1.3 U$1.4 34.34,11.21 33.93,11.62 U$1.42 33.1,11.62 v33.14,11.58 | R11.2 18.04,38.71 17.53,38.71 17.41,38.45 17.42,37.11 18.14,36.32 18.13,35.8 17.92,35.59 U$2.9 17.98,35.59 18.03,35.64
  Top 0.305: R23.2 44.29,5.85 43,5.85
  Top 0.406: 22.56,38.95 R13.2 | 43,5.85 L3.2 42.85,5.55 v43.9,4.5
  Route2 0.305: v33.14,11.58 33.42,11.58 33.9,11.1 33.9,4.1 v33.8,4
  Route15 0.254: v33.14,11.58 33.63,11.58 33.85,11.71 33.85,38.86 v33.62,39
  Bottom 0.254: v33.62,39 v23.49,39 | v12.44,35.13 4.1,35.12 v4.06,34.99
  Bottom 0.305: v43.9,4.5 34.3,4.5 v33.8,4
+BATT  (via drill 0.5)
  Top 0.254: U$2.15 13.61,37.05 13.35,36.79 U$2.16 | U$2.16 | U$2.16 12.34,36.09 11.72,35.59 10.78,35.59 R8.2
  Top 0.305: U$2.15 U$2.14 | J1.2 48.39,40.34 47.87,40.79 17.04,40.79 16.68,41.22 8.62,41.22 v8.42,41.5 | v8.42,37.15 8.42,36 8.94,35.48 R8.2
  Route15 0.305: v8.42,41.5 v8.42,37.15
DBG_RST_N
  Top 0.254: R20.1 36.81,18.55 36.81,19.57 36.46,19.92 33.23,19.92 33.09,20.06 R19.2 33.18,21.23 34.91,21.23 35.25,21.57 35.25,25.8 35.63,26.18 U$3.4
DBGEN_N
  Top 0.254: R18.2 U$3.1
FT_SK
  Top 0.254: R17.2 34.83,29.82 35.32,29.33 35.32,28.74 35.39,28.67 37.18,28.67 U$3.2
FTDI_RX  (via drill 0.5)
  Top 0.254: R6.2 45.12,16.56 45.26,16.42 45.26,9.01 45.62,8.65 48.08,8.65 U11.GPIO_01 | v28.13,18.55 29.05,18.55 CC3200MOD.P46
  Route15 0.254: U11.GPIO_01 49.72,7.61 50.4,8.37 50.4,18.43 50.42,18.49 50.18,18.49 v49.68,19.01
  Bottom 0.254: v49.68,19.01 45.78,19.02 45.22,18.37 28.36,18.37 v28.13,18.55
FTDI_TX  (via drill 0.5)
  Top 0.254: R5.2 5.33,30.1 4.85,30.04 4.85,23.94 U11.GPIO_02 | v26.16,23 26.16,20.1 26.46,19.47 29.08,19.47 CC3200MOD.P47
  Bottom 0.254: U11.GPIO_02 26.12,22.85 v26.16,23
GND  (via drill 0.4, 0.4 pad 0.25, 0.5, 0.6)  (1 unrouted)
  Top 0.254: U1.9 25.85,38.15 26.35,38.15 U1.11 U1.3 26.39,36.59 26.39,33.65 C12.2 25.75,32.94 26.47,32.15 27.36,32.15 27.86,31.72 27.86,30.32 CC3200MOD.P2 CC3200MOD.P1 | U$2.10 15.32,36.09 U$2.21 15.32,36.03 16.32,36.03 U$2.11 16.58,37.32 v16.58,38.25 | U$1.45 32.4,10.12 32.4,9.12 U$1.47 | R9.1 9.87,37.22 R10.1 | C8.2 29.59,35.36 R7.1 | C3.1 C4.1 | C4.1 | C4.1 27.16,5.21 27.66,4.71 28.01,4.71 28.28,4.44 C2.1 | USB.5 37.29,3.29 v37.16,3.16 | v6.45,31.19 7.84,31.19 8.31,30.72 8.31,30.4 8.48,30.23 9.98,30.23 CC3200MOD.P16 | C6.2 C10.2 | U$4.P9 41.52,37.36 v41.52,37.85
  Top 0.406: CC3200MOD.P27 CC3200MOD.P28 | CC3200MOD.P38 22.61,14.27 22.61,13.29 21.82,13.29 v21.82,13.09 | CC3200MOD.P16 10.04,30.32
  other vias: 12.75,9.3 15,9.35 15,10.55 15,11.7 11.8,1.8 11.8,2.8 11.8,3.8 11.8,4.8 11.8,5.8 12.5,6.3 15.3,6.3 16.3,6.3 17.3,6.3 18.3,6.3 19.3,5.8 19.3,4.8 19.3,3.8 19.3,2.8 12.75,10.5 12.75,11.7 44.69,5.13 22.85,2.95 9.01,2.91 9.14,5.14 9.1,8.11 1.25,34.8 31.61,22.99 6.12,39.83 9.9,38.51 28.79,31.5 33.04,10.6 44.1,33.52 31.43,37.87 36.13,30.91 41.55,34.88 36.37,39.17 36.78,36.88 26.44,5.65 17.91,10.37 17.89,8.93 17.86,7.57 19.27,7.57 19.27,8.91 19.27,10.36 20.66,10.36 20.61,8.89 20.61,7.57 22.08,7.59 22.05,8.94 22.03,10.39 23.41,10.37 23.41,8.87 23.41,7.57
  pour Top (no thermals): 52.5,12.4 0,12.5 0,0.3 52.5,0.3
  pour Top: -0.1,12.4 52.5,12.6 52.5,42 -0.2,42
  pour Bottom (no thermals): 8.3,0.3 8.3,12.3 24.3,12.2 24.3,0.2
  pour Route2: 0,0 52.5,0 52.5,42.35 0,42.25
  pour Bottom: 0,0 52.5,0 52.5,44.7 0,44.7
  pour Route15: 0,0 52.5,0 52.5,43.8 0,43.8
GPIO_05  (via drill 0.5)
  Top 0.254: v27,20.22 27.01,23.32 27.29,23.6 29.09,23.6 CC3200MOD.P50 29.2,23.48 30.31,23.48 30.85,23.87 30.85,31.6 31.46,32.36 R7.2 31.46,34.59 v30.73,33.86 | v8.69,34.41 9.42,34.32 R8.1
  Route2 0.254: v8.69,34.41 9.78,34.4 10.08,34.16 30.43,34.16 v30.73,33.86
  Bottom 0.254: v27,20.22 13.15,20.22 13.13,20.2 13.13,20.1 13.03,20 6.25,20 U11.GPIO_05
GPIO_10  (via drill 0.5, 0.6)
  Top 0.254: U$4.P12 38.84,37.92 38.84,38.45 38.81,38.48 38.53,38.48 38.41,38.6 R28.1 38.35,39.36 v37.61,39.36
  Top 0.305: CC3200MOD.P3 v26.58,31.37 v26.57,31.38
  Route15 0.254: v37.61,39.36 37.46,39.51 37.46,41.03 37.04,41.45 26.74,41.45 26.58,41.29 26.58,30.88 26.57,30.87
  Route15 0.305: v26.57,31.38 26.57,30.87 26.57,27.03 v26.69,26.83 | v2.24,26.67 2.24,7.85 2.6,7.49 3.28,7.49 U11.GPIO_10
  Bottom 0.305: v26.69,26.83 2.48,26.83 v2.24,26.67
GPIO_11  (via drill 0.5, 0.6)
  Top 0.254: U11.GPIO_11 1.03,5.07 0.74,5.36 0.74,31.38 v1.22,31.86 | v25.25,31.34 25.25,30.38 CC3200MOD.P4 | U$4.P2 37.52,37.36 37.05,37.83 36.31,37.83 R29.1 35.09,39.37 34.87,39.74 32.54,39.74 32.36,39.41 32.36,32.38 v31.76,31.45
  Bottom 0.254: v1.22,31.86 24.73,31.86 v25.25,31.34 25.25,30.82 25.57,30.5 31,30.5 31.44,30.94 v31.76,31.45
GPIO_13  (via drill 0.5, 0.6)
  Top 0.254: U11.GPIO_13_RX 2.1,22.85 1.5,23.45 1.5,29.31 v1.81,30.01 | v17.68,29.36 CC3200MOD.P10 | R25.1 38.3,34.8 v37.54,35.56
  Route2 0.254: v24.53,34.87 22.85,34.87 22.57,35.15 22.57,41.53 22.45,41.65 17.97,41.65 v17.76,41.54
  Route15 0.254: v17.76,41.54 17.73,29.41 v17.68,29.36
  Bottom 0.254: v1.81,30.01 17.54,30.04 v17.68,29.36 | v37.54,35.56 25.22,35.56 v24.53,34.87
GPIO_22  (via drill 0.5)
  Top 0.305: U11.GPIO_22 50.39,5.07 51.23,5.8 v51.23,13.84 | v16.39,29.13 16.39,30.29 CC3200MOD.P11
  Route15 0.305: v16.49,13.22 16.49,29.03 v16.39,29.13
  Bottom 0.305: v51.23,13.84 16.5,13.84 v16.49,13.22
JTAG_TDI  (via drill 0.5)
  Top 0.254: v14.64,29.3 15.08,29.3 15.28,29.5 15.28,30.18 CC3200MOD.P12
  Route2 0.254: v14.64,29.3 15.11,29.3 15.89,30.08 45.29,30.08 v45.35,30.06
  Route15 0.254: U11.GPIO_23 45.71,7.61 45.31,8.01 v45.35,30.06
JTAG_TDO  (via drill 0.5)
  Top 0.254: U11.GPIO_24 47.04,5.07 v48,6.03 | v8.96,21.07 8.97,27.04 9.31,27.41 10.04,27.41 CC3200MOD.P18
  Route15 0.254: v48,6.03 48,21.52 v47.8,21.72
  Bottom 0.254: v47.8,21.72 9.59,21.72 v8.96,21.07
N$1
  cutout Top: 12.8,0.9 12.65,0.5 12.65,5.5 18.65,5.5 18.75,0.9
N$2
  Top 0.01: C1.1 13.9,7.6 L1.1
  Top 0.5: L1.1 ANT_PAD.FEED2
N$3
  Top 0.01: CC3200MOD.P31 13.9,14.14
  Top 0.5: 13.9,14.14 L1.2
N$4
  cutout Top: 13.2,14.95 13.2,5.5 14.6,5.5 14.6,14.95
N$5
  cutout Route2: 12.66,0.51 12.66,5.49 18.63,5.49 18.66,5.49 18.66,0.51
N$6
  cutout Route15: 12.66,0.51 12.66,5.51 18.66,5.51 18.66,0.51
N$7  (via drill 0.5)
  Top 0.254: U$1.5 34.84,11.6 v34.78,11.82 | v44.1,11.82 44.1,11.09 R1.2
  Bottom 0.254: v34.78,11.82 v44.1,11.82
N$8  (via drill 0.5)
  Top 0.254: CC3200MOD.P6 22.77,31.12 v22.85,31.12
  Route15 0.254: v22.85,31.12 22.86,13.4 v23.44,13.07
  Bottom 0.254: v23.44,13.07 45.16,13.04 45.32,12.88 45.32,11.32 45.24,11.24 48.75,11.24 49.27,11.76 49.27,12.54 U11.GPIO_15_MISO
N$10  (via drill 0.5)
  Top 0.254: U11.GPIO_16_MOSI 50.04,15.23 50.46,15.65 50.46,29.13 v50.39,29.2 | v21.57,29.2 21.57,30.25 CC3200MOD.P7
  Bottom 0.254: v50.39,29.2 v21.57,29.2
N$11  (via drill 0.5)
  Top 0.254: CC3200MOD.P8 20.23,28.74 v20.3,28.67 | v44.6,28.06 44.6,26.57 45.26,26.58 47.52,26.58 47.86,26.24 47.86,23.28 48.22,22.92 49.05,22.92 U11.GPIO_17_CS
  Bottom 0.254: v20.3,28.67 20.54,28.67 20.87,28.34 44.6,28.35 v44.6,28.06
N$12  (via drill 0.5)
  Top 0.254: U11.GPIO_14_SP_CLK 2.13,12.69 1.6,13.22 1.6,18.54 v1.46,18.8 | v23.93,31.15 23.93,30.43 CC3200MOD.P5
  Route15 0.254: v23.94,18.42 v23.94,31.14 v23.93,31.15
  Bottom 0.254: v1.46,18.8 13.06,18.79 13.4,18.4 23.92,18.4 v23.94,18.42
N$13  (via drill 0.5)
  Top 0.254: v13.31,24.1 13.31,25.59 12.8,26.1 CC3200MOD.P19
  Bottom 0.254: U11.GPIO_28 49.12,24.86 48.37,24.11 v13.32,24.11 v13.31,24.1
N$14  (via drill 0.5)
  Top 0.254: v7.19,15.97 7.2,10.38 6.78,9.96 6.13,9.96 U11.GPIO_30 | v27.46,16.17 27.46,14.66 CC3200MOD.P42
  Bottom 0.254: v27.46,16.17 7.23,16.17 v7.19,15.97
N$15
  Top 0.305: 40.7,5.7 39.9,4.9
  Top 0.406: L3.1 40.7,5.7 | 39.9,4.9 USB.1
N$17
  Top 0.254: R9.2 12.05,38.82 12.31,38.44 15.42,38.44 15.82,38.04 U$2.12
N$18  (via drill 0.5)
  Top 0.254: CC3200MOD.P51 29.68,24.83 30.06,25.21 30.06,26.03 v30.13,26.04
  Route15 0.254: v30.13,26.04 30.13,17.73 v30.21,17.65
  Bottom 0.254: v30.21,17.65 15.88,17.67 15.29,17.08 15.29,16.84 15.16,16.71 3.73,16.71 3.36,17.08 3.36,17.73 U11.GPIO_06
N$19  (via drill 0.5)
  Top 0.254: CC3200MOD.P49 28.23,22.29 v27.82,22.7 | v7.51,22.12 7.51,21.82 7.15,21.46 2.46,21.46 2.25,21.13 2.25,15.51 2.46,15.18 3.35,15.18 U11.GPIO_04
  Bottom 0.254: v7.51,22.12 7.68,22.29 28.24,22.29 v27.83,22.7 v27.82,22.7
N$20
  Top 0.254: R10.2 12.27,37.17 12.88,37.78 15.19,37.78 15.32,37.65 U$2.13
N$21  (via drill 0.5)
  Top 0.254: CC3200MOD.P52 28.21,26.1 v27.79,25.68 | v7.27,17.51 7.25,17.2 7.05,17.04 6.81,17.04 6.25,16.48 4.79,16.48 4.75,16.44 4.75,10.36 4.42,10.03 3.52,10.03 U11.GPIO_07
  Route15 0.254: v14.33,25.71 v14.33,17.51
  Bottom 0.254: v27.79,25.68 14.36,25.68 v14.33,25.71 | v14.33,17.51 v7.27,17.51
N$22  (via drill 0.5)
  Top 0.254: CC3200MOD.P53 27.89,27.37 v27.8,27.56
  Route15 0.254: v8.24,28 v8.24,13.25
  Bottom 0.254: v27.8,27.56 8.82,27.56 v8.24,28 | v8.24,13.25 6.5,13.25 U11.GPIO_08
N$23  (via drill 0.5)
  Top 0.305: v30.16,32.53 30.16,29.1 29.72,28.66 29.15,28.66 CC3200MOD.P54
  Route15 0.305: U11.GPIO_09 4.71,7.61 4.67,7.65 4.67,32.33 v4.29,32.61
  Bottom 0.305: v4.29,32.61 30.08,32.61 v30.16,32.53
N$25  (via drill 0.5)
  Top 0.254: CC3200MOD.P9 18.96,28.91 18.95,28.9 18.95,28.79 v18.74,28.43
  Route15 0.254: v15.57,28.41 15.58,19.26 v15.51,19.24
  Bottom 0.254: v18.74,28.43 16.18,28.41 v15.57,28.41 | v15.51,19.24 3.65,19.27 3.42,19.5 3.42,20.29 U11.GPIO_12_TX
N$26
  Top 0.254: PWR.A 22.31,31.97 21.94,31.6 17.62,31.6 17.28,31.94 U$2.6
N$27  (via drill 0.5)
  Top 0.254: CC3200MOD.P48 28.66,21.02 v28.32,20.68
  Route15 0.254: v12.5,20.97 12.51,23.61 v12.26,23.92
  Bottom 0.254: v12.5,20.97 27.86,20.97 28.24,20.68 v28.32,20.68 | v12.26,23.92 3.7,23.92 3.45,24.17 3.45,25.34 U11.GPIO_03
N$28  (via drill 0.5)
  Top 0.254: v9,31.03 9.4,31.19 9.39,31.28
  Top 0.305: U$2.5 16.32,31.55 15.92,31.29 9.39,31.28 v9,31.03
  Route2 0.254: 8.7,31.5 8.83,31.5 v9,31.03
  Route2 0.305: 8.7,31.5 v8.7,33.39
  Bottom 0.305: v8.7,33.39 9.65,33.39 THERMAL.2
N$29
  Top 0.254: U1.4 26.86,35.77 27.13,35.5 27.13,35.24 L2.1
N$30
  Top 0.254: U1.2 25.84,35.2 L2.2
N$31
  Top 0.254: U$2.7 17.96,34.59 18.17,34.38 18.17,33.14 18.35,32.96 20.64,32.98 | 20.62,32.95 20.64,32.98 | 20.64,32.98 20.64,33.64 DONE.A
N$32
  Top 0.254: U$2.8 18.31,35.09 CHARG/LBO.A
N$33
  Top 0.254: R11.1 19.13,37 CHARG/LBO.C
N$35
  Top 0.254: R12.1 20.46,35.93 DONE.C
N$36
  Top 0.254: R13.1 22.63,35.89 PWR.C
N$37  (via drill 0.5)
  Top 0.254: U$2.2 14.82,32.45 14.54,32.21 7.99,32.21 7.59,32.57 7.59,34.19 R15.2
  Top 0.305: R14.1 13.71,39.24 v13.07,39.88 | v7.59,39.88 7.59,34.21 R15.2
  Bottom 0.305: v13.07,39.88 v7.59,39.88
N$38
  Top 0.254: U$1.43 27.01,11.12 26.52,10.63 Q1.2 26.46,9.7 25.83,9.7 25.49,9.36 25.49,3.99 25.9,3.58 C2.2
N$40
  Top 0.254: U$1.44 29.32,10.62 29.06,10.36 Q1.1 29.06,7.82 C3.2
N$41
  Top 0.254: USB.3 38.59,5.01 38.43,5.17 33.66,5.17 32.97,4.48 32.97,2.92 32.66,2.61 R4.1
N$42  (via drill 0.5)
  Top 0.254: R2.1 44.13,15.44 40.18,15.44 v39.87,15.45 | v39.29,5.72 39.29,4.24 USB.2
  Route15 0.254: v39.87,15.45 39.87,6.3 v39.29,5.72
N$43
  Top 0.254: U$1.6 35.34,6.21 35.18,6.1 30.18,6.1 29.8,5.67 28.5,5.67 C4.2
N$44  (via drill 0.5)
  Top 0.254: R5.1 7.66,29.92 7.98,29.6 10.76,29.6 10.92,29.44 10.92,28.42 11.13,28.21 13.19,28.21 14.17,27.23 15.1,27.23 16.12,26.21 16.12,20.1 16.75,19.47 16.75,18.05 v17.91,16.89 | v26.97,11.93 27.68,12.64 31.32,12.64 U$1.40
  Route15 0.254: v26.52,16.9 26.52,12.38 v26.97,11.93
  Bottom 0.254: v17.91,16.89 26,16.89 26.05,16.94 26.44,16.94 v26.52,16.9
N$45  (via drill 0.5)
  Top 0.254: R6.1 v41.32,16.56 | v30.36,16.56 30.36,13.22 30.48,13.1 31.32,13.1 U$1.39
  Bottom 0.254: v41.32,16.56 v30.36,16.56
N$46  (via drill 0.5)
  Top 0.254: U$1.24 40.29,14.12 v40.61,14.6 | v32.71,31 32.04,29.92 R17.1
  Route15 0.254: v40.61,14.6 40.62,31.5 v40.63,31.79
  Bottom 0.254: v40.63,31.79 32.7,31.76 v32.71,31
N$47  (via drill 0.5)
  Top 0.254: U$1.19 38.1,11.62 v37.51,11.03 | v31.91,20.17 R19.1
  Route15 0.254: v37.51,11.03 37.51,21.1 v37.49,21
  Bottom 0.254: v37.49,21 32.06,21.01 31.92,21.14 v31.91,20.17
N$48  (via drill 0.5)
  Top 0.254: U$1.17 38.81,10.62 v38.79,10.6 | v38.79,30.99 38.79,32.31 R18.1
  Route15 0.254: v38.79,10.6 v38.79,30.99
N$49
  Top 0.254: R21.2 40.4,18.5 40.4,24.28 39.77,24.91 U$3.5
N$50  (via drill 0.5)
  Top 0.254: U$3.6 39.04,23.64 v39.56,23.2 | v33.14,17.31 33.16,18.38 R22.2
  Route15 0.254: v33.08,22.98 33.08,17.27 v33.14,17.31
  Bottom 0.254: v39.56,23.2 33.3,23.2 v33.08,22.98
N$51  (via drill 0.5)
  Top 0.254: R23.1 41.45,6.97 v41.42,6.94 | v29.82,6.78 29.82,8.61 30.15,8.94 30.15,9.48 30.26,9.59 31.31,9.59 U$1.46
  Top 0.305: C5.2 R23.1
  Bottom 0.254: v41.42,6.94 29.86,6.94 v29.82,6.78
N$52
  Top 0.254: U$4.P5 38.88,35.91 39.09,35.7 39.79,35.7 39.98,35.51 39.98,34.75 R25.2
N$53
  Top 0.406: R24.1 46.08,3.1 S1.4 S1.3
N_RESET  (via drill 0.5, 0.6)
  Top 0.254: R22.1 v31.37,19.28 | v19.59,19.28 19.51,19.28 19.18,18.95 19.18,14.48 CC3200MOD.P35 18.93,12.32 24.92,12.35 24.96,1.15 26.57,1.14 | v32.55,1.12 26.57,1.14 | R26.2 26.73,1.31 26.57,1.14
  Top 0.406: S1.1 S1.2 51.35,1.25 v51.35,1.76
  Route2 0.254: v51.35,1.76 51.35,2.99 50.45,3.89 50.45,16.98 49.71,17.72 49.17,17.72 U11.RESET_OUT
  Bottom 0.254: v31.37,19.28 v19.59,19.28 | v51.35,1.76 32.55,1.76 v32.55,1.12
OUT  (via drill 0.5)
  Top 0.254: U$2.20 13.35,33.32 13.55,33.12 U$2.1 13.14,33.12 v12.9,33.37 | U1.6 27.67,39.54 27.92,39.29 27.92,36.87 27.94,36.85 27.68,36.59 U1.5 28.04,36.59 28.26,36.37 28.26,33.82 C12.1 27.93,33.37 v28.98,33.38
  Top 0.305: U1.6 U1.7 U1.8
  Bottom 0.254: v12.9,33.37 28.86,33.37 v28.98,33.38
SOP2  (via drill 0.5)
  Top 0.254: U11.GPIO_25 49.18,10.09 49.77,10.09 50.37,10.69 50.37,13.28 49.86,13.79 48.25,13.79 47.82,14.22 47.82,18.5 47.26,19.06 45.34,19.06 44.48,19.92 R3.1 44.61,20.4 v44.61,25.58 | R16.1 31.92,25.93 v31.94,25.91 32.03,25.82 v32.03,25.08 | CC3200MOD.P23 11.12,21.02 v11.42,21.01
  Route15 0.254: v11.42,21.01 11.39,24.67 v11.63,24.91 11.63,28.97 v11.7,29.04 | v3.9,29.25 3.9,30.67 3.55,31.02 3.55,34.29 3.53,34.23 4.92,34.23 5.36,34.71 5.36,36.93 5.52,37.09 5.52,37.68 SOP2.1
  Bottom 0.254: v31.94,25.91 44.28,25.91 v44.61,25.58 | v11.63,24.91 31.86,24.91 v32.03,25.08 | v11.7,29.04 4.11,29.04 v3.9,29.25
TCK
  Top 0.254: R16.2 37.21,27.43 U$3.3
USB_DM
  Top 0.254: U$1.8 36.34,5.8 36.09,5.64 31.34,5.64 30.96,5.17 30.96,4.36 R4.2
USB_DP  (via drill 0.5)
  Top 0.254: R2.2 R1.1 41.7,11.04 41.59,10.93 41.59,8.34 v41.39,8.14 | v35.84,8.15 U$1.7
  Bottom 0.254: v41.39,8.14 v35.85,8.14 v35.84,8.15
VCC  (via drill 0.5)
  Top 0.254: U1.1 24.95,36.59 24.75,36.79 24.75,39.34 24.95,39.54 U1.10 25.36,40.27 25.47,40.33 29.26,40.33 29.61,40.03 29.61,39.9 | U$1.14 36.13,9.12 35.66,9.62 | 35.66,9.62 v35.59,9.69 | v35.59,9.69 35.52,9.77 35.52,14.37 35.32,14.53 35.32,14.72 | 35.32,14.72 35.32,15.6 U$1.31 35.34,16.7 35.16,16.88 v35.16,17.31 R20.2 | 29.61,39.9 29.61,39.09 C8.1 | 42.61,36.35 U$3.14 42.61,34.39 41.65,33.37 35.27,33.37 v35.25,33.36 34.97,33.64 C10.1 C6.1 34.98,37.82 R29.2 | 42.61,36.35 42.61,38.66 41.17,40.28 39.71,40.28 | 39.71,40.28 29.81,40.28 29.61,39.9 | SOP2.2 2.88,28.45 U11.3.3V | CC3200MOD.P37 21.51,14.96 21.73,15.18 25.06,15.18 25.36,14.88 25.36,14.74 | CC3200MOD.P40 25.36,14.31 25.36,14.74 | 25.36,14.74 v25.72,15.21 | 35.32,14.72 35.27,14.49 32.46,14.49 v31.74,15.21 | U$4.P3 38.4,36.9 38.97,36.9 39.38,37.31 U$4.P11 39.38,38.43 39.71,38.76 R28.2 39.71,40.28 | U$4.P7 42.59,36.34 42.61,36.35 | R26.1 29.49,2 v29.51,1.98 | v35.59,9.69 35.66,9.62
  Top 0.305: CC3200MOD.P36 CC3200MOD.P37 | 24.75,36.79 24.75,36.73 v24.34,35.85
  Route15 0.254: v35.25,33.36 35.3,17.2 v35.16,17.31 | v29.51,1.98 30.68,1.98 31.15,2.45 31.15,9.4 31.66,9.91 35.38,9.91 v35.59,9.69
  Bottom 0.254: v25.72,15.21 v31.74,15.21
  Bottom 0.305: v24.34,35.85 3.85,35.93 2.88,37.15 SOP2.2